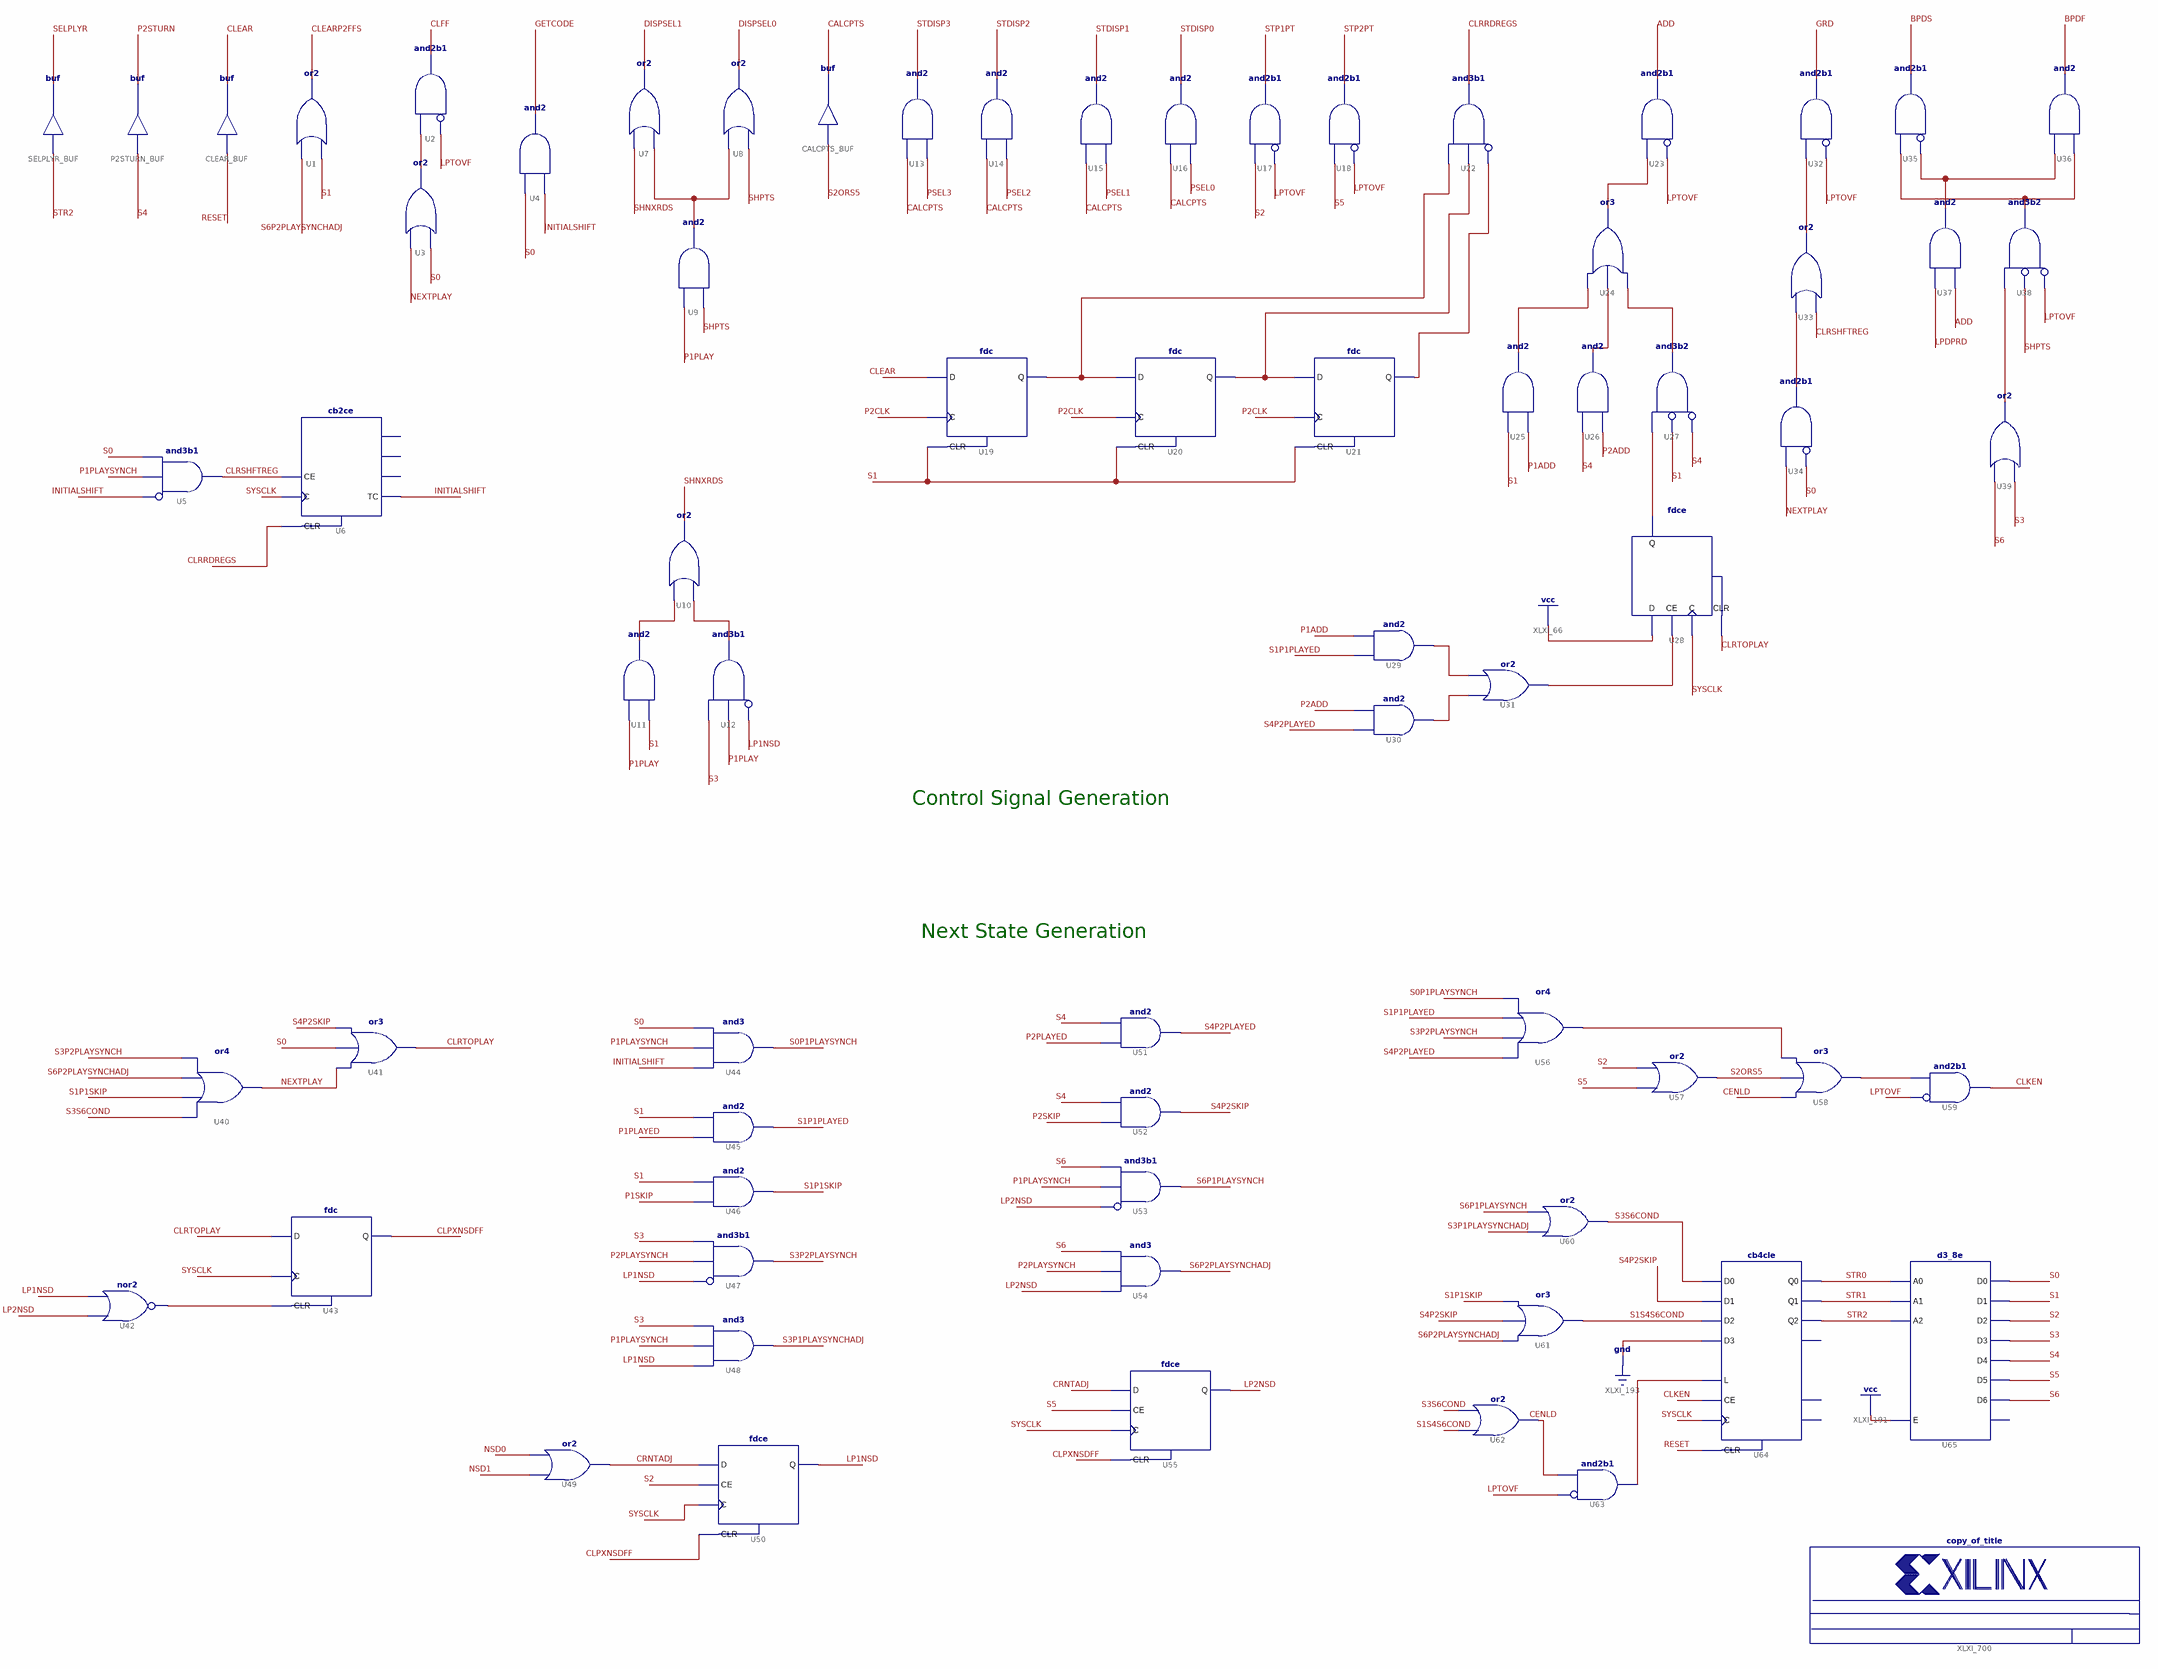
[diagram p0: schematic sheet 1]
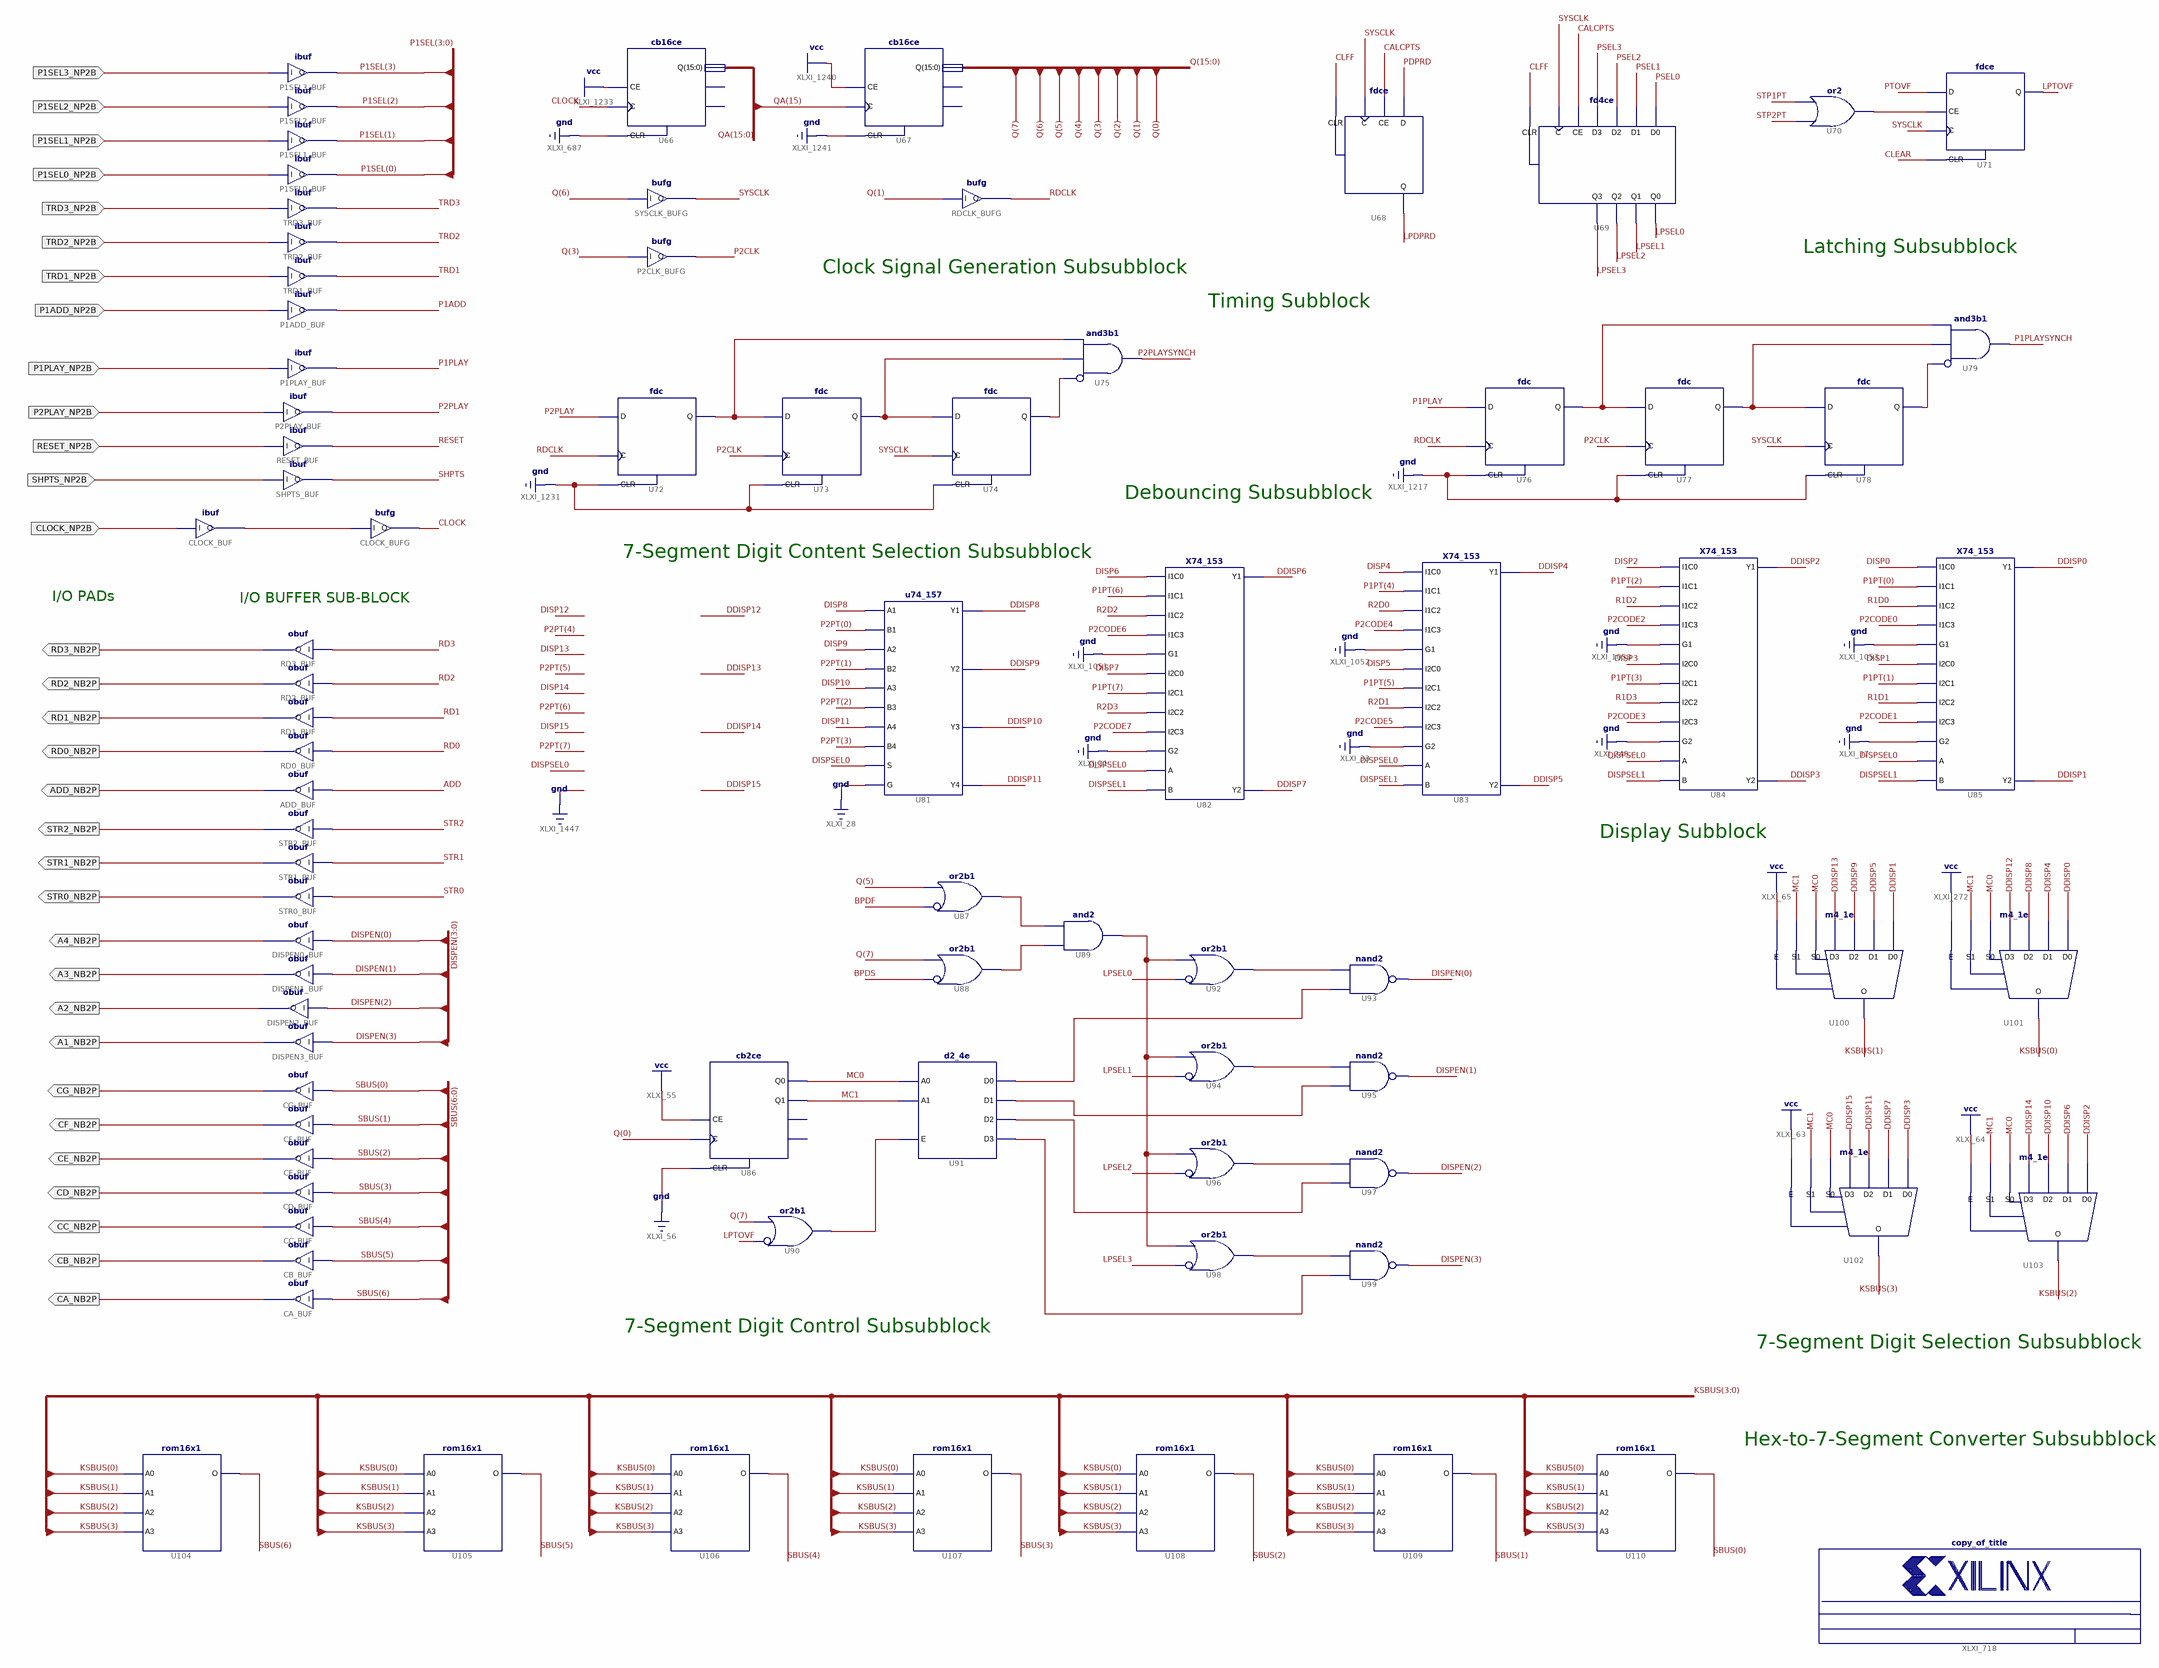
[diagram p1: schematic sheet 2]
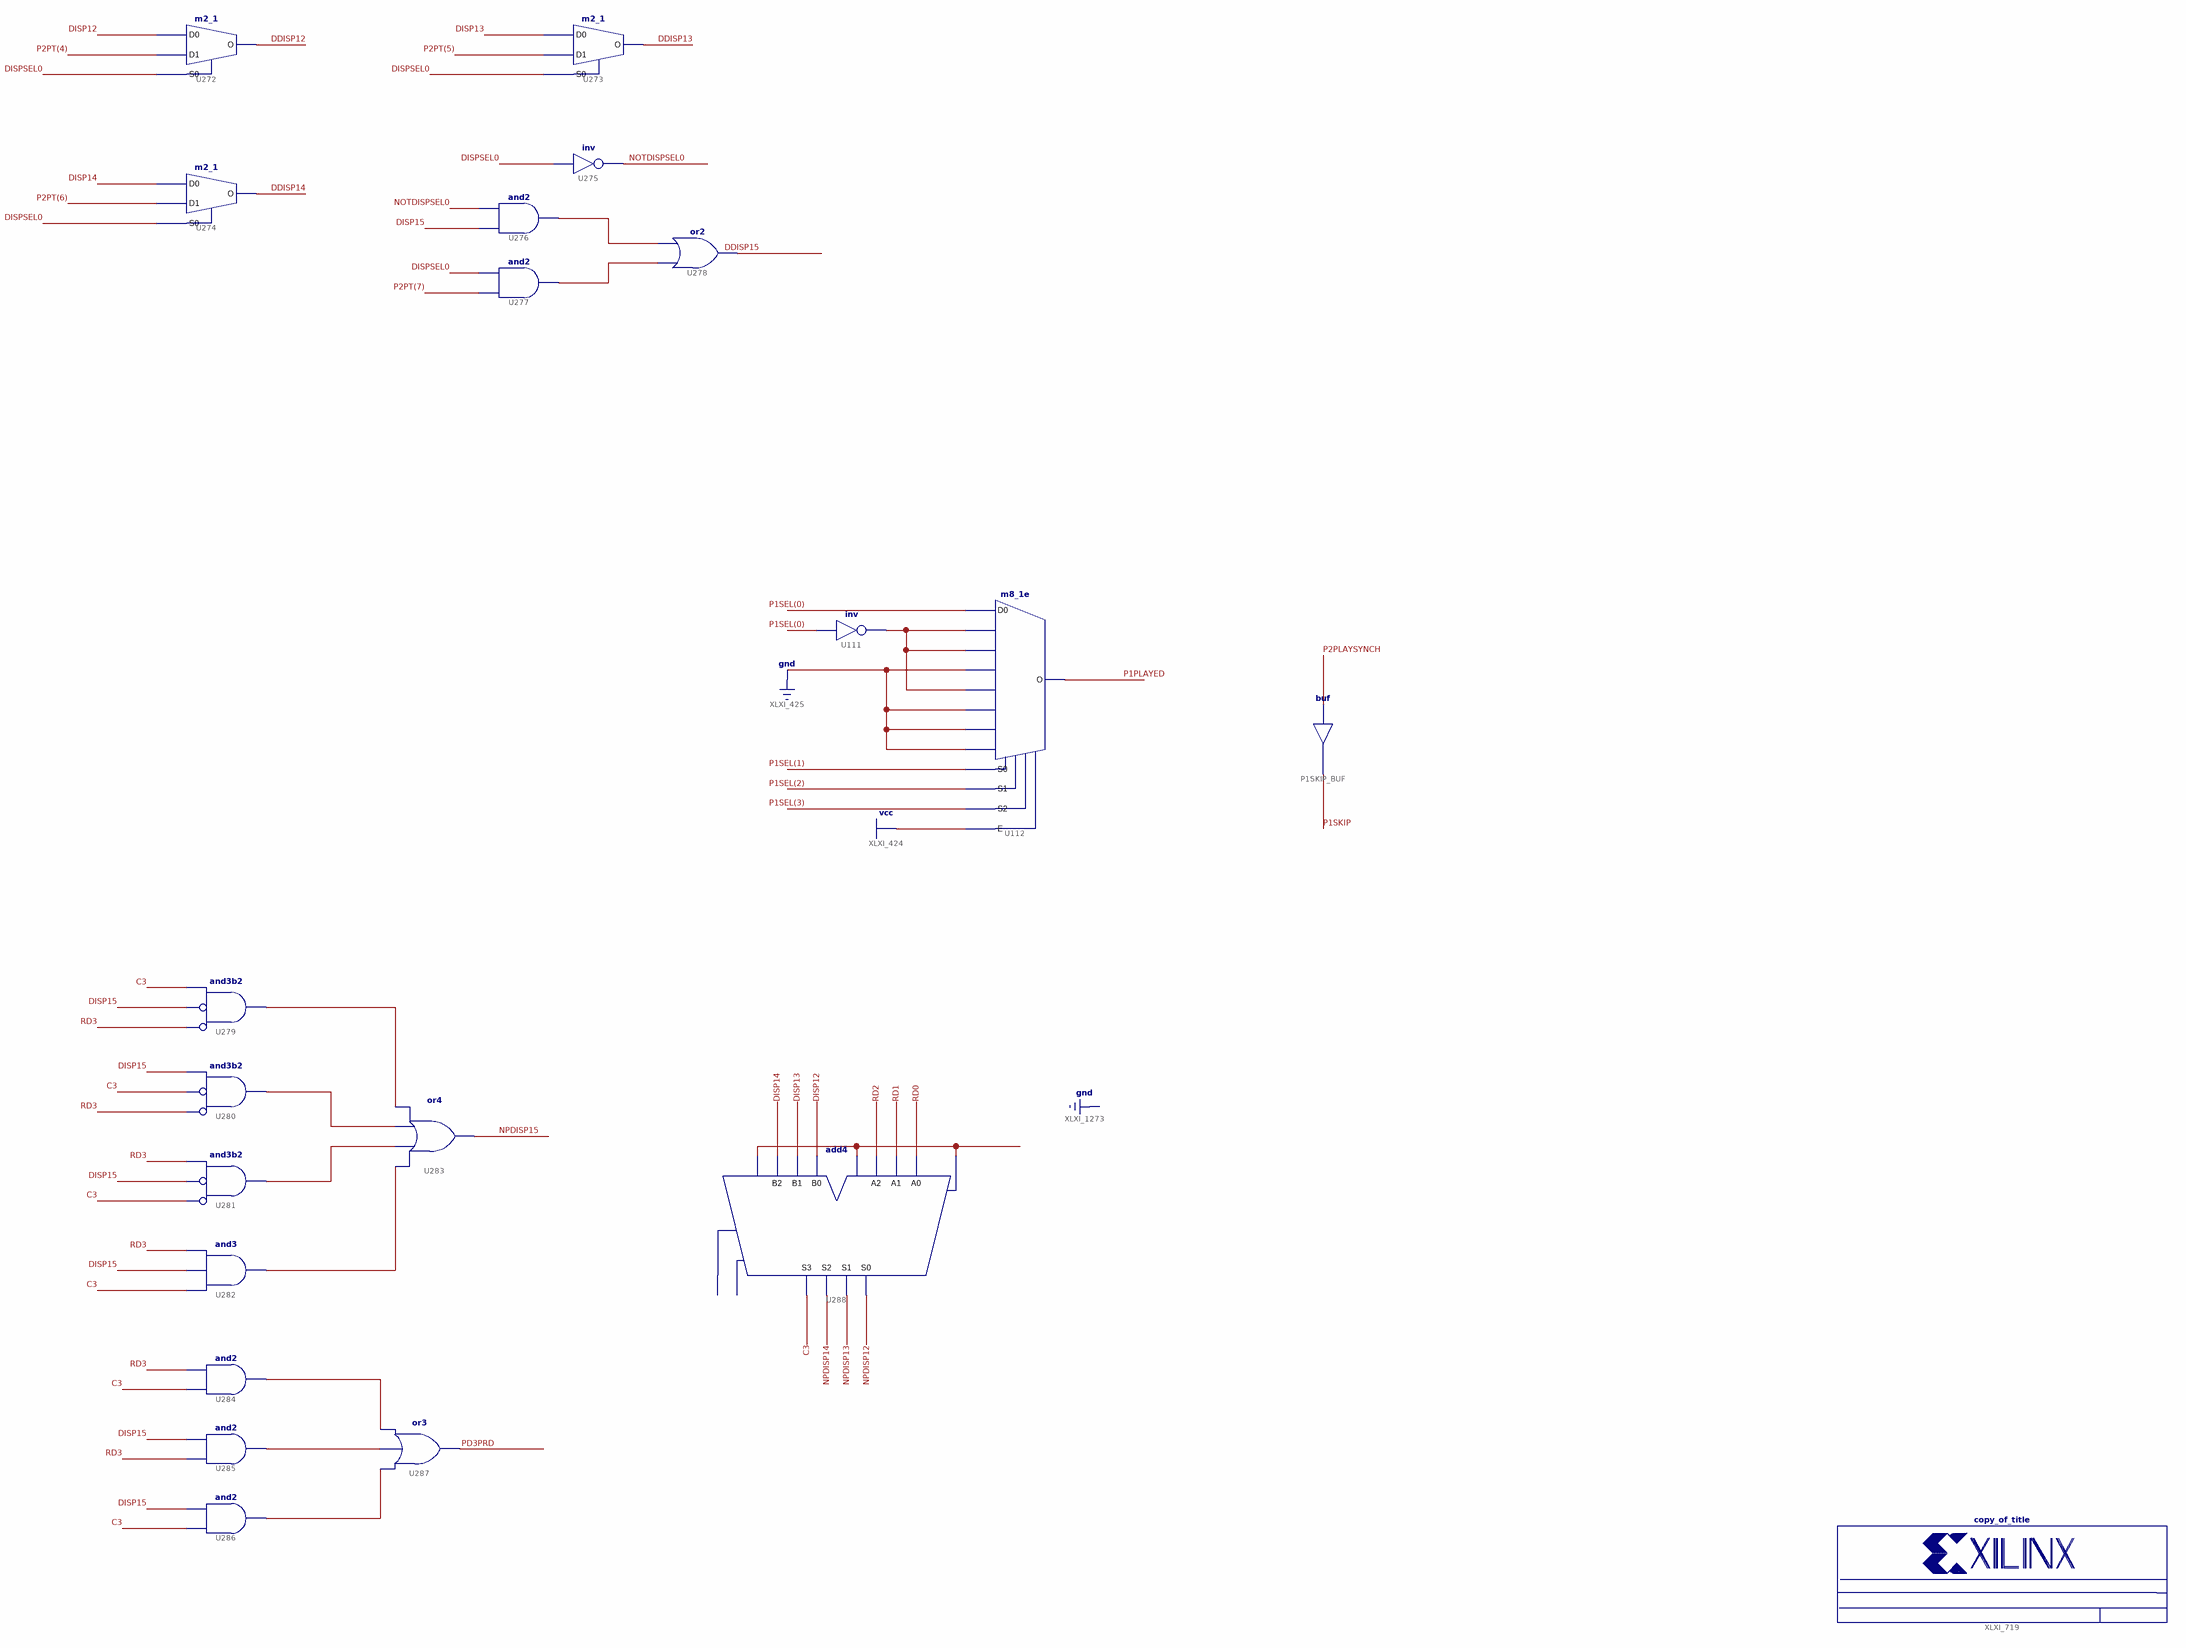
[diagram p2: schematic sheet 3]
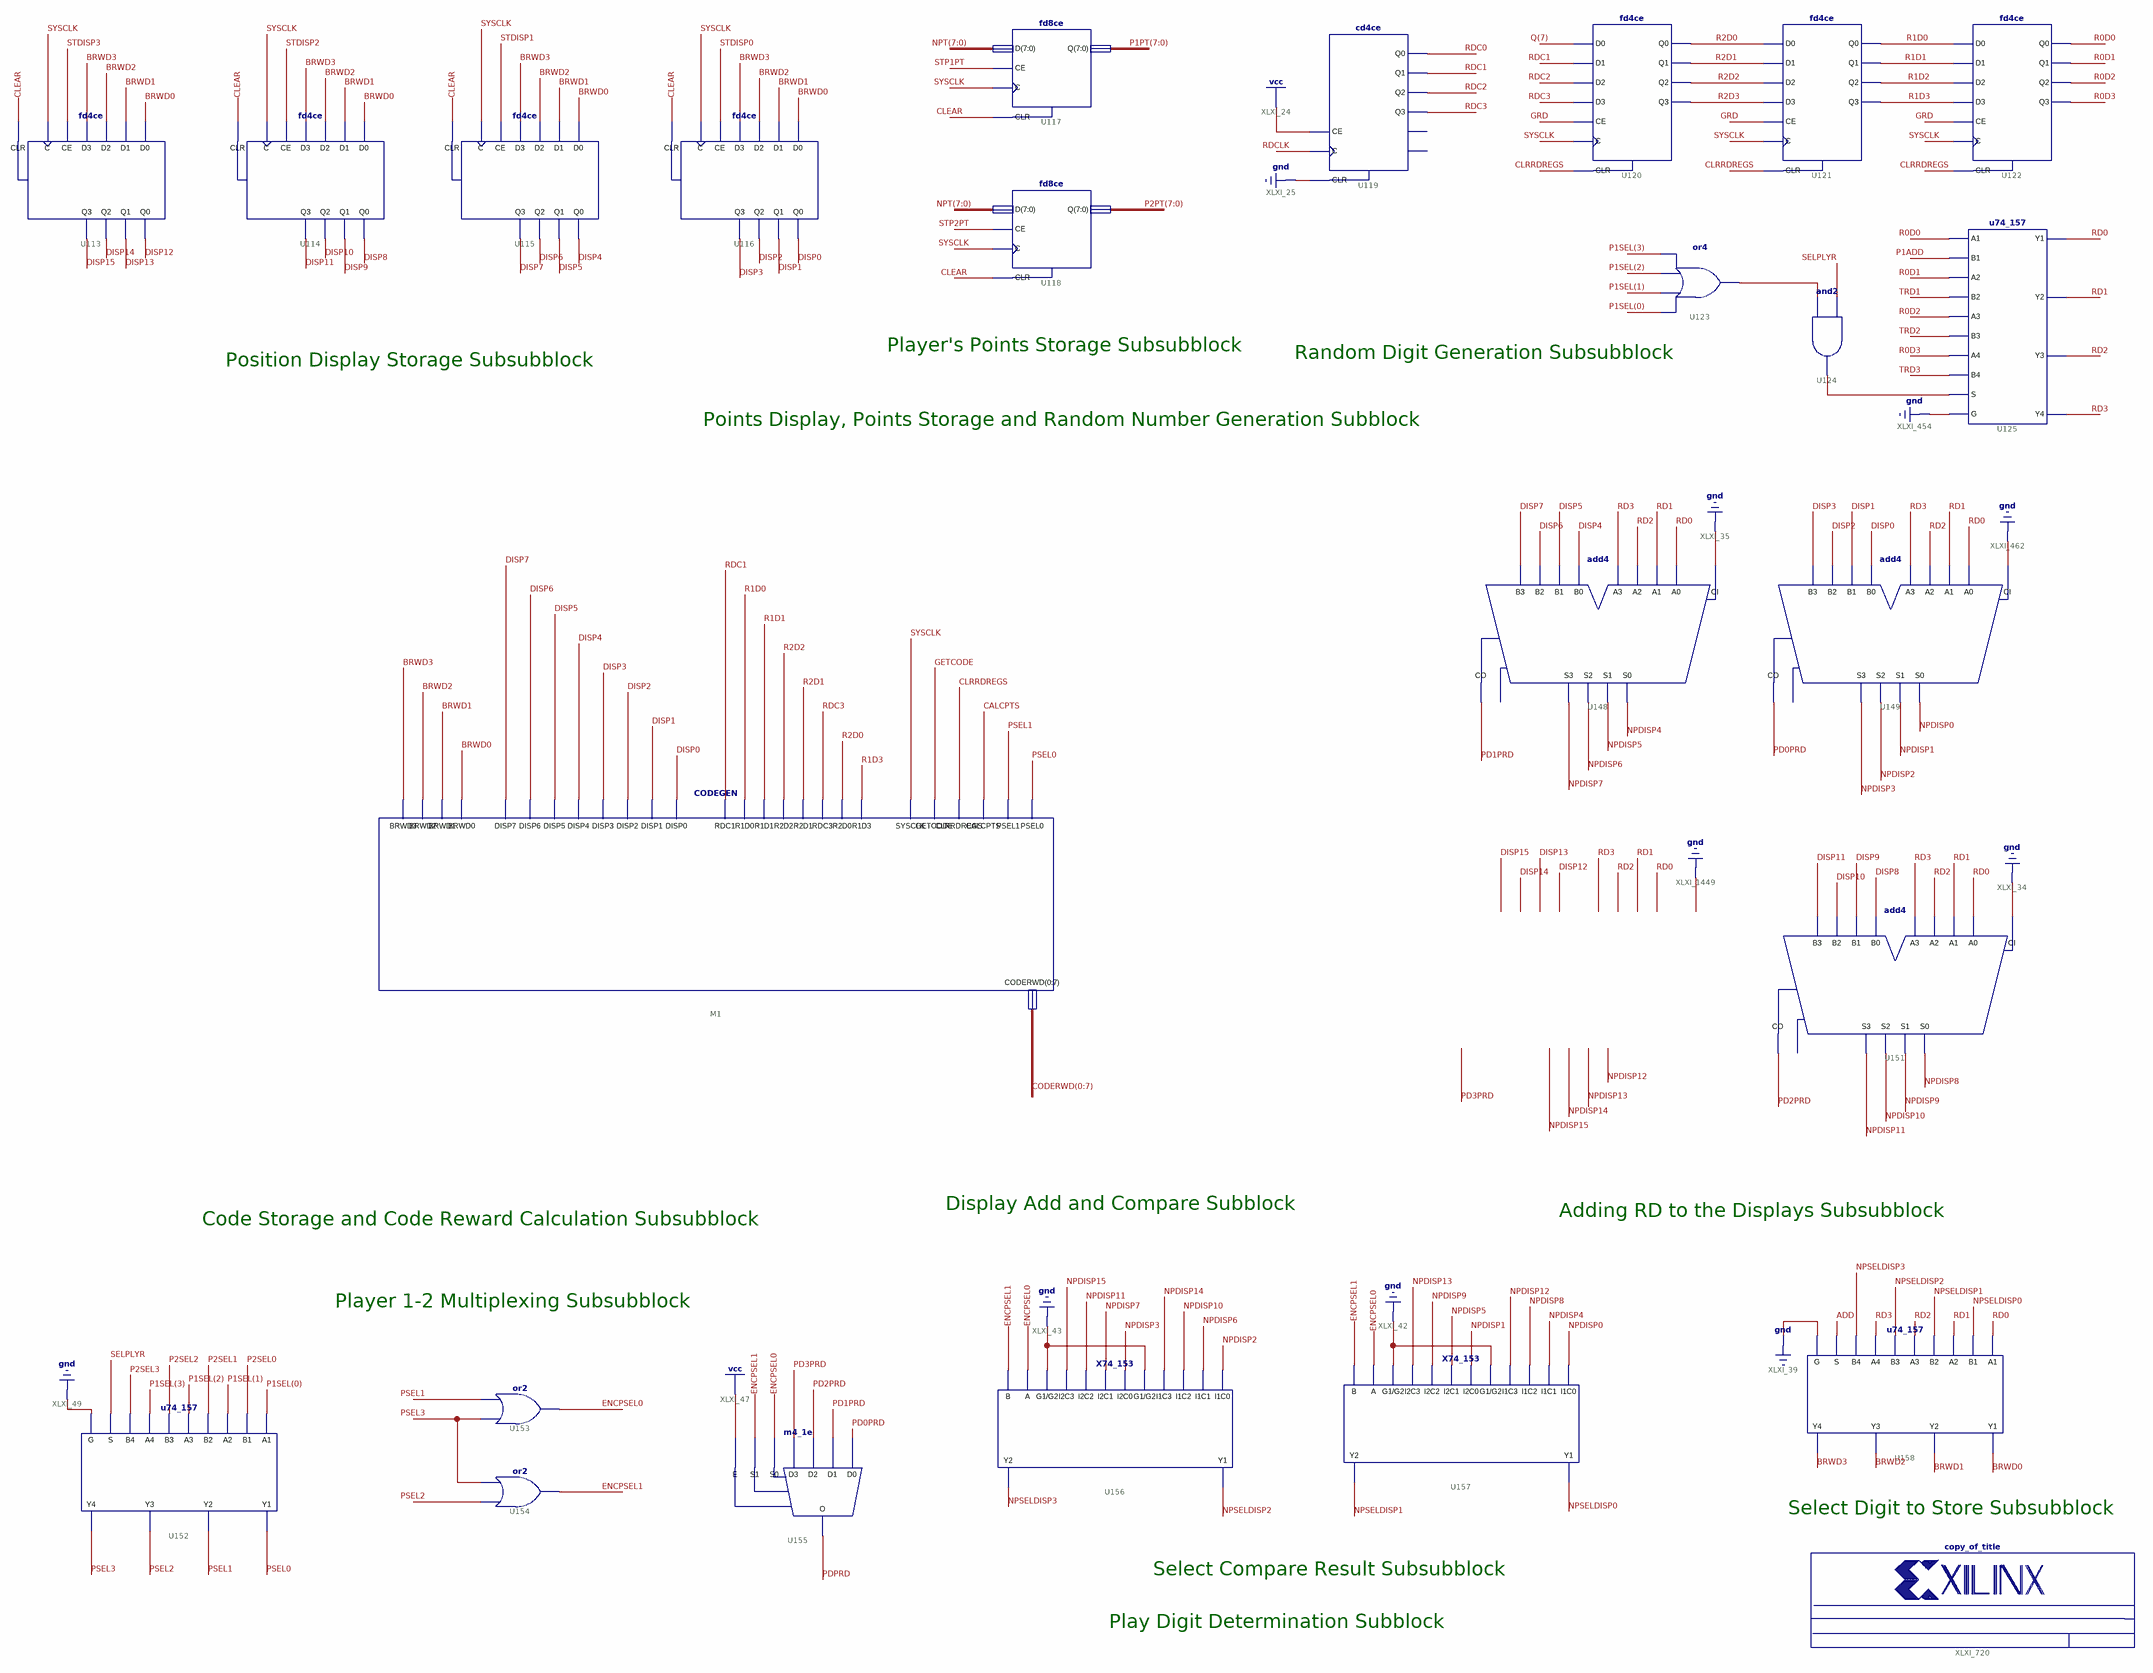
[diagram p3: schematic sheet 4]
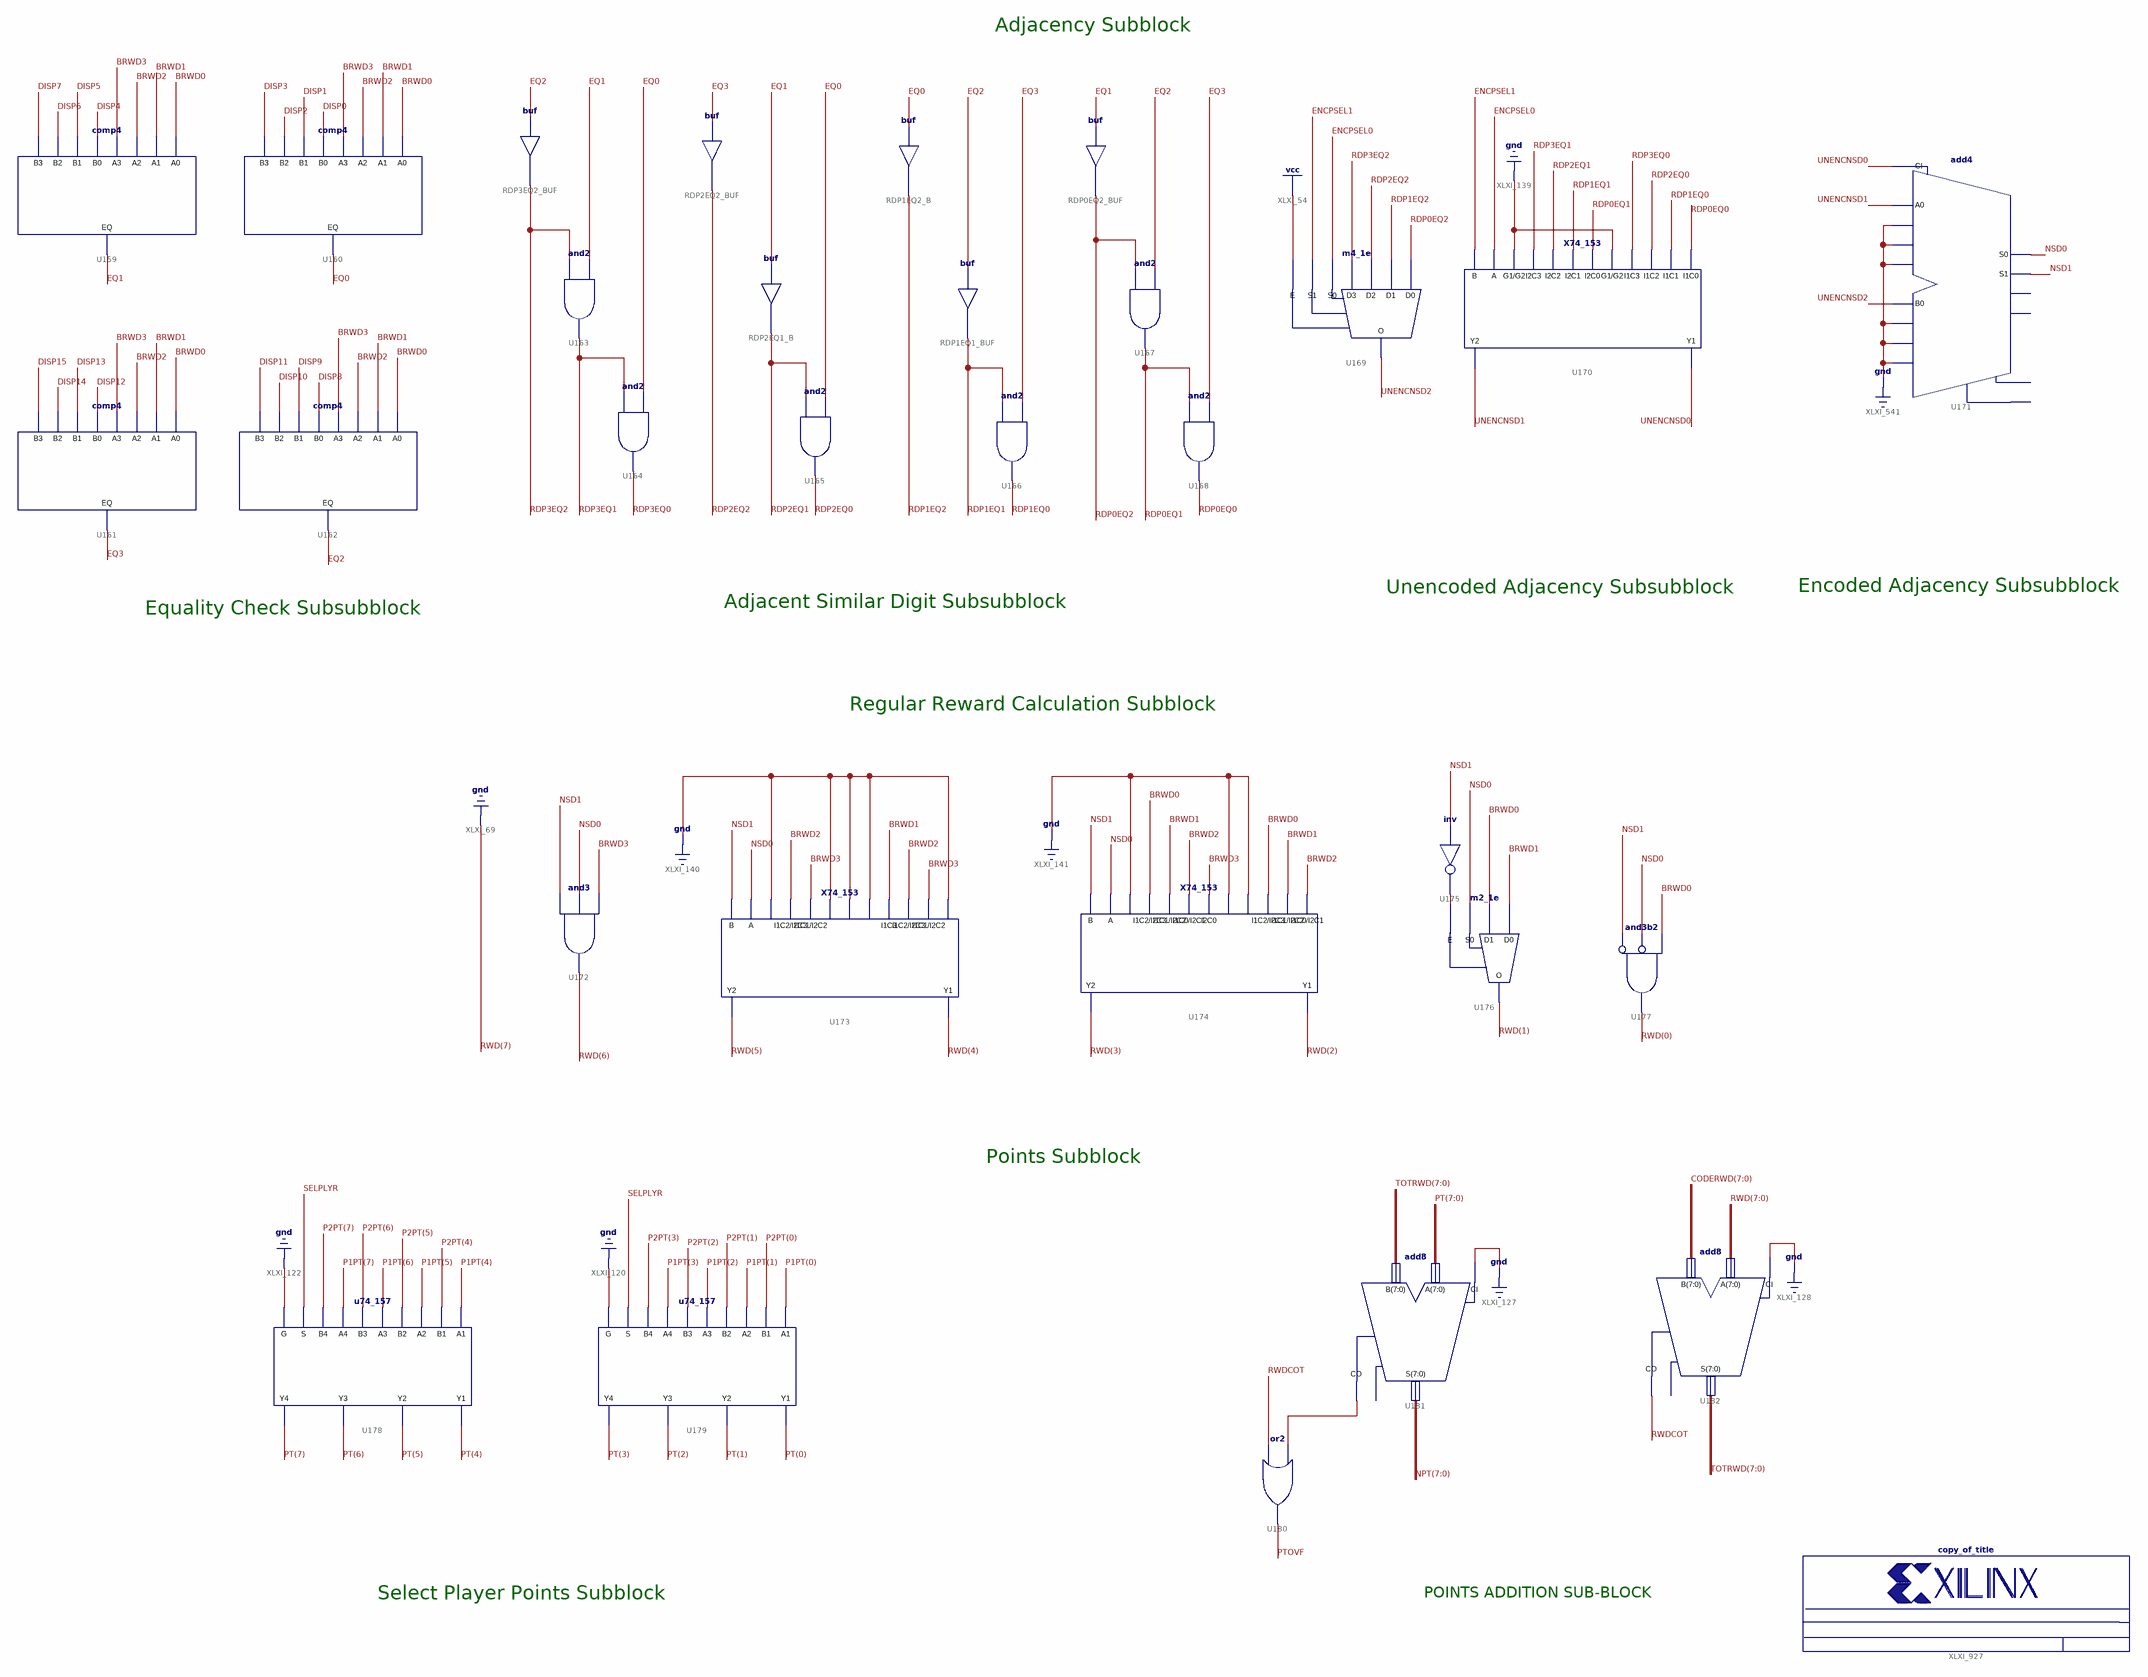
[diagram p4: schematic sheet 5]
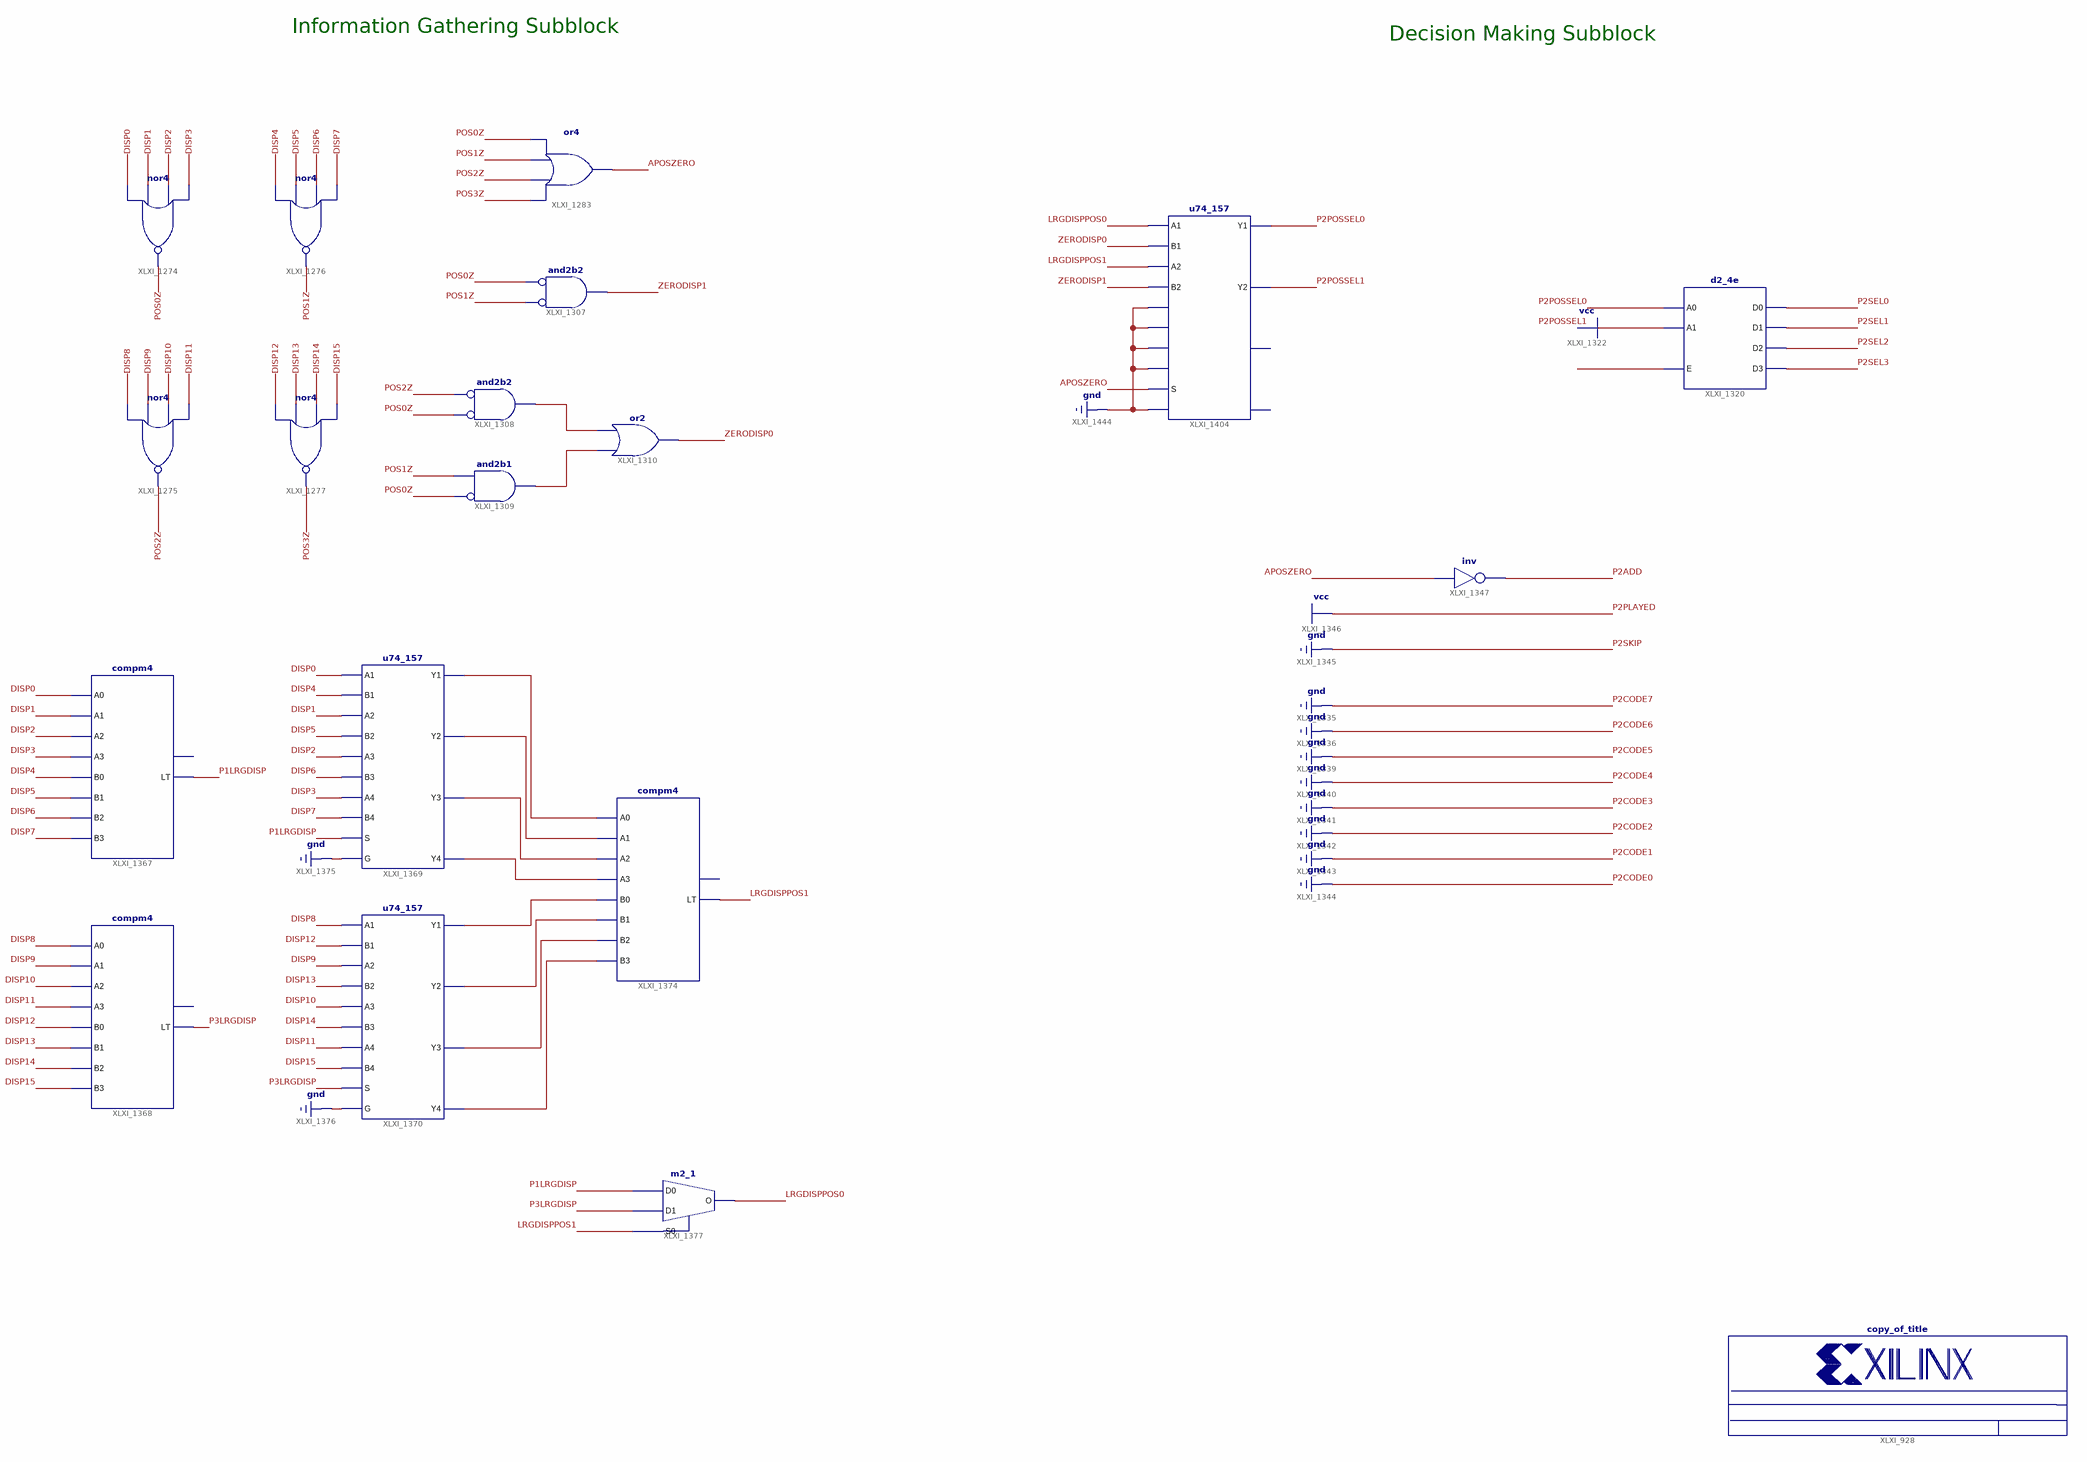
[diagram p5: schematic sheet 6]
// Xilinx ISE schematic ppm.sch (spartan3e) as structural Verilog: 247 symbols, 32 ports
module ppm (
  input  P1ADD_NP2B,
  input  TRD1_NP2B,
  input  TRD2_NP2B,
  input  TRD3_NP2B,
  input  P1SEL0_NP2B,
  input  P1SEL1_NP2B,
  input  P1SEL2_NP2B,
  input  P1SEL3_NP2B,
  input  P1PLAY_NP2B,
  input  RESET_NP2B,
  input  SHPTS_NP2B,
  input  CLOCK_NP2B,
  input  P2PLAY_NP2B,
  output RD3_NB2P,
  output RD2_NB2P,
  output RD1_NB2P,
  output RD0_NB2P,
  output ADD_NB2P,
  output STR2_NB2P,
  output STR1_NB2P,
  output STR0_NB2P,
  output A4_NB2P,
  output A3_NB2P,
  output A1_NB2P,
  output CG_NB2P,
  output CF_NB2P,
  output CE_NB2P,
  output CD_NB2P,
  output CC_NB2P,
  output CB_NB2P,
  output CA_NB2P,
  output A2_NB2P
);

  wire ADD, APOSZERO, BPDF, BPDS, BRWD0, BRWD1, BRWD2, BRWD3, C3, CALCPTS, CENLD, CLEAR, CLEARP2FFS, CLFF,
       CLKEN, CLOCK, CLPXNSDFF, CLRRDREGS, CLRSHFTREG, CLRTOPLAY, CRNTADJ, DDISP0, DDISP1, DDISP2, DDISP3,
       DDISP4, DDISP5, DDISP6, DDISP7, DDISP8, DDISP9, DDISP10, DDISP11, DDISP12, DDISP13, DDISP14, DDISP15,
       DISP0, DISP1, DISP2, DISP3, DISP4, DISP5, DISP6, DISP7, DISP8, DISP9, DISP10, DISP11, DISP12, DISP13,
       DISP14, DISP15, DISPSEL0, DISPSEL1, ENCPSEL0, ENCPSEL1, EQ0, EQ1, EQ2, EQ3, GETCODE, GRD,
       INITIALSHIFT, INT_NET0, INT_NET1, INT_NET2, INT_NET3, INT_NET6, INT_NET8, INT_NET10, INT_NET11,
       LP1NSD, LP2NSD, LPDPRD, LPSEL0, LPSEL1, LPSEL2, LPSEL3, LPTOVF, LRGDISPPOS0, LRGDISPPOS1, MC0, MC1,
       NEXTPLAY, NOTDISPSEL0, NPDISP0, NPDISP1, NPDISP2, NPDISP3, NPDISP4, NPDISP5, NPDISP6, NPDISP7,
       NPDISP8, NPDISP9, NPDISP10, NPDISP11, NPDISP12, NPDISP13, NPDISP14, NPDISP15, NPSELDISP0, NPSELDISP1,
       NPSELDISP2, NPSELDISP3, NSD0, NSD1, P1ADD, P1LRGDISP, P1PLAY, P1PLAYED, P1PLAYSYNCH, P1SKIP, P2ADD,
       P2CLK, P2PLAY, P2PLAYSYNCH, P2POSSEL0, P2POSSEL1, P2SEL0, P2SEL1, P2SEL2, P2SEL3, P2STURN, P3LRGDISP,
       PD0PRD, PD1PRD, PD2PRD, PD3PRD, PDPRD, POS0Z, POS1Z, POS2Z, POS3Z, PSEL0, PSEL1, PSEL2, PSEL3, PTOVF,
       R0D0, R0D1, R0D2, R0D3, R1D0, R1D1, R1D2, R1D3, R2D0, R2D1, R2D2, R2D3, RD0, RD1, RD2, RD3, RDC0,
       RDC1, RDC2, RDC3, RDCLK, RDP0EQ0, RDP0EQ1, RDP0EQ2, RDP1EQ0, RDP1EQ1, RDP1EQ2, RDP2EQ0, RDP2EQ1,
       RDP2EQ2, RDP3EQ0, RDP3EQ1, RDP3EQ2, RESET, RWDCOT, S0, S0P1PLAYSYNCH, S1, S1P1PLAYED, S1P1SKIP,
       S1S4S6COND, S2, S2ORS5, S3, S3P1PLAYSYNCHADJ, S3P2PLAYSYNCH, S3S6COND, S4, S4P2PLAYED, S4P2SKIP, S5,
       S6, S6P1PLAYSYNCH, S6P2PLAYSYNCHADJ, SELPLYR, SHNXRDS, SHPTS, STDISP0, STDISP1, STDISP2, STDISP3,
       STP1PT, STP2PT, STR0, STR1, STR2, SYSCLK, TRD1, TRD2, TRD3, UNENCNSD0, UNENCNSD1, UNENCNSD2, XLXN_12,
       XLXN_19, XLXN_74, XLXN_140, XLXN_141, XLXN_149, XLXN_151, XLXN_156, XLXN_163, XLXN_164, XLXN_181,
       XLXN_188, XLXN_193, XLXN_194, XLXN_195, XLXN_197, XLXN_199, XLXN_201, XLXN_202, XLXN_203, XLXN_210,
       XLXN_460, XLXN_462, XLXN_474, XLXN_1195, XLXN_1346, XLXN_1347, XLXN_1764, XLXN_1802, XLXN_2370,
       XLXN_9551, XLXN_9714, XLXN_10471, XLXN_10478, XLXN_10482, XLXN_10484, XLXN_10495, XLXN_10958,
       XLXN_10960, XLXN_10962, XLXN_11102, XLXN_11289, XLXN_11290, XLXN_11291, XLXN_11292, XLXN_11293,
       XLXN_11294, XLXN_11314, XLXN_11315, XLXN_11316, XLXN_11554, XLXN_11555, XLXN_11725, XLXN_11726,
       XLXN_11727, XLXN_11728, XLXN_11729, XLXN_11730, XLXN_11731, XLXN_11732, ZERODISP0, ZERODISP1;
  wire [3:0] DISPEN, KSBUS, P1SEL;
  wire [6:0] RWD, SBUS;
  wire [7:0] CODERWD, NPT, P1PT, P2PT, PT, TOTRWD;
  wire [15:0] Q, QA;

  m8_1e U112 (
    .D0(P1SEL[0]), .D1(XLXN_1195), .D2(XLXN_1195), .D3(1'b0), .D4(XLXN_1195), .D5(1'b0), .D6(1'b0),
    .D7(1'b0), .E(1'b1), .S0(P1SEL[1]), .S1(P1SEL[2]), .S2(P1SEL[3]), .O(P1PLAYED));
  not U111 (XLXN_1195, P1SEL[0]);
  X74_153 U85 (
    .I1C0(DISP0), .I1C1(P1PT[0]), .I1C2(R1D0), .I1C3(1'b0), .G1(1'b0), .I2C0(DISP1), .I2C1(P1PT[1]),
    .I2C2(R1D1), .I2C3(1'b0), .G2(1'b0), .A(DISPSEL0), .B(DISPSEL1), .Y1(DDISP0), .Y2(DDISP1));
  X74_153 U84 (
    .I1C0(DISP2), .I1C1(P1PT[2]), .I1C2(R1D2), .I1C3(1'b0), .G1(1'b0), .I2C0(DISP3), .I2C1(P1PT[3]),
    .I2C2(R1D3), .I2C3(1'b0), .G2(1'b0), .A(DISPSEL0), .B(DISPSEL1), .Y1(DDISP2), .Y2(DDISP3));
  X74_153 U83 (
    .I1C0(DISP4), .I1C1(P1PT[4]), .I1C2(R2D0), .I1C3(1'b0), .G1(1'b0), .I2C0(DISP5), .I2C1(P1PT[5]),
    .I2C2(R2D1), .I2C3(1'b0), .G2(1'b0), .A(DISPSEL0), .B(DISPSEL1), .Y1(DDISP4), .Y2(DDISP5));
  X74_153 U82 (
    .I1C0(DISP6), .I1C1(P1PT[6]), .I1C2(R2D2), .I1C3(1'b0), .G1(1'b0), .I2C0(DISP7), .I2C1(P1PT[7]),
    .I2C2(R2D3), .I2C3(1'b0), .G2(1'b0), .A(DISPSEL0), .B(DISPSEL1), .Y1(DDISP6), .Y2(DDISP7));
  rom16x1 #(.INIT("2812")) U104 (.A0(KSBUS[0]), .A1(KSBUS[1]), .A2(KSBUS[2]), .A3(KSBUS[3]), .O(SBUS[6]));
  rom16x1 #(.INIT("D860")) U105 (.A0(KSBUS[0]), .A1(KSBUS[1]), .A2(KSBUS[2]), .A3(KSBUS[3]), .O(SBUS[5]));
  rom16x1 #(.INIT("D004")) U106 (.A0(KSBUS[0]), .A1(KSBUS[1]), .A2(KSBUS[2]), .A3(KSBUS[3]), .O(SBUS[4]));
  rom16x1 #(.INIT("8692")) U107 (.A0(KSBUS[0]), .A1(KSBUS[1]), .A2(KSBUS[2]), .A3(KSBUS[3]), .O(SBUS[3]));
  rom16x1 #(.INIT("02BA")) U108 (.A0(KSBUS[0]), .A1(KSBUS[1]), .A2(KSBUS[2]), .A3(KSBUS[3]), .O(SBUS[2]));
  rom16x1 #(.INIT("208E")) U109 (.A0(KSBUS[0]), .A1(KSBUS[1]), .A2(KSBUS[2]), .A3(KSBUS[3]), .O(SBUS[1]));
  rom16x1 #(.INIT("1083")) U110 (.A0(KSBUS[0]), .A1(KSBUS[1]), .A2(KSBUS[2]), .A3(KSBUS[3]), .O(SBUS[0]));
  and U5 (CLRSHFTREG, ~INITIALSHIFT, P1PLAYSYNCH, S0);  // and3b1
  and U29 (XLXN_164, S1P1PLAYED, P1ADD);
  and U30 (XLXN_163, S4P2PLAYED, P2ADD);
  or U31 (INT_NET10, XLXN_163, XLXN_164);
  fdce U28 (.C(SYSCLK), .CE(INT_NET10), .CLR(CLRTOPLAY), .D(1'b1), .Q(XLXN_156));
  and U48 (S3P1PLAYSYNCHADJ, LP1NSD, P1PLAYSYNCH, S3);
  and U47 (S3P2PLAYSYNCH, ~LP1NSD, P2PLAYSYNCH, S3);  // and3b1
  and U46 (S1P1SKIP, P1SKIP, S1);
  and U45 (S1P1PLAYED, P1PLAYED, S1);
  and U44 (S0P1PLAYSYNCH, INITIALSHIFT, P1PLAYSYNCH, S0);
  nor U42 (INT_NET11, LP2NSD, LP1NSD);
  fdc U43 (.C(SYSCLK), .CLR(INT_NET11), .D(CLRTOPLAY), .Q(CLPXNSDFF));
  and U63 (XLXN_474, ~LPTOVF, CENLD);  // and2b1
  or U60 (S3S6COND, S3P1PLAYSYNCHADJ, S6P1PLAYSYNCH);
  cb4cle U64 (
    .C(SYSCLK), .CE(CLKEN), .CLR(RESET), .D0(S3S6COND), .D1(S4P2SKIP), .D2(S1S4S6COND), .D3(1'b0),
    .L(XLXN_474), .Q0(STR0), .Q1(STR1), .Q2(STR2));  // open: CEO, Q3, TC
  d3_8e U65 (
    .A0(STR0), .A1(STR1), .A2(STR2), .E(1'b1), .D0(S0), .D1(S1), .D2(S2), .D3(S3), .D4(S4), .D5(S5), .D6(S6));  // open: D7
  or U40 (NEXTPLAY, S3S6COND, S1P1SKIP, S6P2PLAYSYNCHADJ, S3P2PLAYSYNCH);
  or U41 (CLRTOPLAY, NEXTPLAY, S0, S4P2SKIP);
  or U88 (XLXN_203, ~BPDS, Q[7]);  // or2b1
  cb2ce U86 (.C(Q[0]), .CE(1'b1), .CLR(1'b0), .Q0(MC0), .Q1(MC1));  // open: CEO, TC
  d2_4e U91 (.A0(MC0), .A1(MC1), .E(XLXN_210), .D0(INT_NET3), .D1(XLXN_197), .D2(XLXN_199), .D3(XLXN_201));
  and U89 (INT_NET0, XLXN_203, XLXN_202);
  or U92 (XLXN_181, ~LPSEL0, INT_NET0);  // or2b1
  or U94 (XLXN_195, ~LPSEL1, INT_NET0);  // or2b1
  or U96 (XLXN_194, ~LPSEL2, INT_NET0);  // or2b1
  or U98 (XLXN_193, ~LPSEL3, INT_NET0);  // or2b1
  or U90 (XLXN_210, ~LPTOVF, Q[7]);  // or2b1
  nand U95 (DISPEN[1], XLXN_197, XLXN_195);
  nand U97 (DISPEN[2], XLXN_199, XLXN_194);
  nand U99 (DISPEN[3], XLXN_201, XLXN_193);
  nand U93 (DISPEN[0], INT_NET3, XLXN_181);
  or U87 (XLXN_202, ~BPDF, Q[5]);  // or2b1
  u74_157 U81 (
    .S(DISPSEL0), .G(1'b0), .Y1(DDISP8), .Y2(DDISP9), .Y3(DDISP10), .Y4(DDISP11), .A1(DISP8), .B4(P2PT[3]),
    .B1(P2PT[0]), .A4(DISP11), .A2(DISP9), .B3(P2PT[2]), .B2(P2PT[1]), .A3(DISP10));
  ibuf P1SEL3_BUF (.I(P1SEL3_NP2B), .O(P1SEL[3]));
  ibuf P1SEL2_BUF (.I(P1SEL2_NP2B), .O(P1SEL[2]));
  ibuf P1SEL1_BUF (.I(P1SEL1_NP2B), .O(P1SEL[1]));
  ibuf P1SEL0_BUF (.I(P1SEL0_NP2B), .O(P1SEL[0]));
  ibuf TRD3_BUF (.I(TRD3_NP2B), .O(TRD3));
  ibuf TRD2_BUF (.I(TRD2_NP2B), .O(TRD2));
  ibuf TRD1_BUF (.I(TRD1_NP2B), .O(TRD1));
  ibuf P1ADD_BUF (.I(P1ADD_NP2B), .O(P1ADD));
  ibuf RESET_BUF (.I(RESET_NP2B), .O(RESET));
  ibuf SHPTS_BUF (.I(SHPTS_NP2B), .O(SHPTS));
  ibuf CLOCK_BUF (.I(CLOCK_NP2B), .O(XLXN_2370));
  bufg CLOCK_BUFG (.I(XLXN_2370), .O(CLOCK));
  ibuf P1PLAY_BUF (.I(P1PLAY_NP2B), .O(P1PLAY));
  obuf RD3_BUF (.I(RD3), .O(RD3_NB2P));
  obuf RD2_BUF (.I(RD2), .O(RD2_NB2P));
  obuf RD1_BUF (.I(RD1), .O(RD1_NB2P));
  obuf RD0_BUF (.I(RD0), .O(RD0_NB2P));
  obuf ADD_BUF (.I(ADD), .O(ADD_NB2P));
  obuf STR2_BUF (.I(STR2), .O(STR2_NB2P));
  obuf STR1_BUF (.I(STR1), .O(STR1_NB2P));
  obuf STR0_BUF (.I(STR0), .O(STR0_NB2P));
  obuf DISPEN0_BUF (.I(DISPEN[0]), .O(A4_NB2P));
  obuf DISPEN1_BUF (.I(DISPEN[1]), .O(A3_NB2P));
  obuf DISPEN2_BUF (.I(DISPEN[2]), .O(A2_NB2P));
  obuf DISPEN3_BUF (.I(DISPEN[3]), .O(A1_NB2P));
  obuf CG_BUF (.I(SBUS[0]), .O(CG_NB2P));
  obuf CF_BUF (.I(SBUS[1]), .O(CF_NB2P));
  obuf CE_BUF (.I(SBUS[2]), .O(CE_NB2P));
  obuf CD_BUF (.I(SBUS[3]), .O(CD_NB2P));
  obuf CC_BUF (.I(SBUS[4]), .O(CC_NB2P));
  obuf CB_BUF (.I(SBUS[5]), .O(CB_NB2P));
  obuf CA_BUF (.I(SBUS[6]), .O(CA_NB2P));
  buf SELPLYR_BUF (SELPLYR, STR2);
  buf P2STURN_BUF (P2STURN, S4);
  or U1 (CLEARP2FFS, S1, S6P2PLAYSYNCHADJ);
  and U2 (CLFF, ~LPTOVF, XLXN_12);  // and2b1
  or U3 (XLXN_12, S0, NEXTPLAY);
  or U7 (DISPSEL1, XLXN_19, SHNXRDS);
  or U8 (DISPSEL0, SHPTS, XLXN_19);
  and U9 (XLXN_19, SHPTS, P1PLAY);
  or U10 (SHNXRDS, XLXN_141, XLXN_140);
  and U11 (XLXN_140, S1, P1PLAY);
  and U12 (XLXN_141, ~LP1NSD, P1PLAY, S3);  // and3b1
  buf CALCPTS_BUF (CALCPTS, S2ORS5);
  and U13 (STDISP3, PSEL3, CALCPTS);
  and U14 (STDISP2, PSEL2, CALCPTS);
  and U36 (BPDF, INT_NET1, INT_NET2);
  and U38 (INT_NET1, ~LPTOVF, ~SHPTS, XLXN_188);  // and3b2
  and U37 (INT_NET2, ADD, LPDPRD);
  and U35 (BPDS, ~INT_NET2, INT_NET1);  // and2b1
  or U33 (INT_NET6, CLRSHFTREG, INT_NET8);
  and U34 (INT_NET8, ~S0, NEXTPLAY);  // and2b1
  and U32 (GRD, ~LPTOVF, INT_NET6);  // and2b1
  and U27 (XLXN_151, ~S4, ~S1, XLXN_156);  // and3b2
  or U24 (XLXN_9551, XLXN_151, XLXN_149, XLXN_9714);
  and U15 (STDISP1, PSEL1, CALCPTS);
  and U25 (XLXN_9714, P1ADD, S1);
  and U26 (XLXN_149, P2ADD, S4);
  or U39 (XLXN_188, S3, S6);
  or U62 (CENLD, S1S4S6COND, S3S6COND);
  fdce U50 (.C(SYSCLK), .CE(S2), .CLR(CLPXNSDFF), .D(CRNTADJ), .Q(LP1NSD));
  or U49 (CRNTADJ, NSD1, NSD0);
  fdce U55 (.C(SYSCLK), .CE(S5), .CLR(CLPXNSDFF), .D(CRNTADJ), .Q(LP2NSD));
  and U54 (S6P2PLAYSYNCHADJ, LP2NSD, P2PLAYSYNCH, S6);
  and U53 (S6P1PLAYSYNCH, ~LP2NSD, P1PLAYSYNCH, S6);  // and3b1
  and U52 (S4P2SKIP, 1'b0, S4);
  and U51 (S4P2PLAYED, 1'b1, S4);
  or U56 (XLXN_460, S4P2PLAYED, S3P2PLAYSYNCH, S1P1PLAYED, S0P1PLAYSYNCH);
  and U59 (CLKEN, ~LPTOVF, XLXN_462);  // and2b1
  or U57 (S2ORS5, S5, S2);
  or U58 (XLXN_462, CENLD, S2ORS5, XLXN_460);
  or U61 (S1S4S6COND, S6P2PLAYSYNCHADJ, S4P2SKIP, S1P1SKIP);
  m4_1e U103 (.D0(DDISP2), .D1(DDISP6), .D2(DDISP10), .D3(DDISP14), .E(1'b1), .S0(MC0), .S1(MC1), .O(KSBUS[2]));
  m4_1e U102 (.D0(DDISP3), .D1(DDISP7), .D2(DDISP11), .D3(DDISP15), .E(1'b1), .S0(MC0), .S1(MC1), .O(KSBUS[3]));
  m4_1e U101 (.D0(DDISP0), .D1(DDISP4), .D2(DDISP8), .D3(DDISP12), .E(1'b1), .S0(MC0), .S1(MC1), .O(KSBUS[0]));
  m4_1e U100 (.D0(DDISP1), .D1(DDISP5), .D2(DDISP9), .D3(DDISP13), .E(1'b1), .S0(MC0), .S1(MC1), .O(KSBUS[1]));
  copy_of_title #(.TitleFieldText("Ppm Control Unit      CS2204 - E - Fall 2013"), .NameFieldText("Benson Tsai; Sharan Juangphanich; Alvi Kabir; Sean Whalen")) XLXI_700 ();
  fd4ce U122 (
    .C(SYSCLK), .CE(GRD), .CLR(CLRRDREGS), .D0(R1D0), .D1(R1D1), .D2(R1D2), .D3(R1D3), .Q0(R0D0), .Q1(R0D1),
    .Q2(R0D2), .Q3(R0D3));
  fd4ce U121 (
    .C(SYSCLK), .CE(GRD), .CLR(CLRRDREGS), .D0(R2D0), .D1(R2D1), .D2(R2D2), .D3(R2D3), .Q0(R1D0), .Q1(R1D1),
    .Q2(R1D2), .Q3(R1D3));
  fd4ce U120 (
    .C(SYSCLK), .CE(GRD), .CLR(CLRRDREGS), .D0(Q[7]), .D1(RDC1), .D2(RDC2), .D3(RDC3), .Q0(R2D0), .Q1(R2D1),
    .Q2(R2D2), .Q3(R2D3));
  or U123 (XLXN_1347, P1SEL[0], P1SEL[1], P1SEL[2], P1SEL[3]);
  and U124 (XLXN_1346, XLXN_1347, SELPLYR);
  cd4ce U119 (.C(RDCLK), .CE(1'b1), .CLR(1'b0), .Q0(RDC0), .Q1(RDC1), .Q2(RDC2), .Q3(RDC3));  // open: CEO, TC
  fd8ce U117 (.C(SYSCLK), .CE(STP1PT), .CLR(CLEAR), .D(NPT), .Q(P1PT));
  fd8ce U118 (.C(SYSCLK), .CE(STP2PT), .CLR(CLEAR), .D(NPT), .Q(P2PT));
  m4_1e U155 (.D0(PD0PRD), .D1(PD1PRD), .D2(PD2PRD), .D3(PD3PRD), .E(1'b1), .S0(ENCPSEL0), .S1(ENCPSEL1), .O(PDPRD));
  u74_157 U152 (
    .S(SELPLYR), .G(1'b0), .Y1(PSEL0), .Y2(PSEL1), .Y3(PSEL2), .Y4(PSEL3), .A1(P1SEL[0]), .B4(P2SEL3),
    .B1(P2SEL0), .A4(P1SEL[3]), .A2(P1SEL[1]), .B3(P2SEL2), .B2(P2SEL1), .A3(P1SEL[2]));
  or U153 (ENCPSEL0, PSEL3, PSEL1);
  or U154 (ENCPSEL1, PSEL2, PSEL3);
  u74_157 U158 (
    .S(ADD), .G(1'b0), .Y1(BRWD0), .Y2(BRWD1), .Y3(BRWD2), .Y4(BRWD3), .A1(RD0), .B4(NPSELDISP3),
    .B1(NPSELDISP0), .A4(RD3), .A2(RD1), .B3(NPSELDISP2), .B2(NPSELDISP1), .A3(RD2));
  copy_of_title #(.TitleFieldText("Ppm Input/Output Block      CS2204 - E - Fall 2013"), .NameFieldText("Benson Tsai; Sharan Juangphanich; Alvi Kabir; Sean Whalen")) XLXI_718 ();
  copy_of_title #(.TitleFieldText("Ppm Human Play Block      CS2204 - E - Fall 2013"), .NameFieldText("Benson Tsai; Sharan Juangphanich; Alvi Kabir; Sean Whalen")) XLXI_719 ();
  copy_of_title #(.TitleFieldText("Ppm Play Check Block      CS2204 - E - Fall 2013"), .NameFieldText("Benson Tsai; Sharan Juangphanich; Alvi Kabir; Sean Whalen")) XLXI_720 ();
  X74_153 U157 (
    .I1C0(NPDISP0), .I1C1(NPDISP4), .I1C2(NPDISP8), .I1C3(NPDISP12), .G1(1'b0), .I2C0(NPDISP1),
    .I2C1(NPDISP5), .I2C2(NPDISP9), .I2C3(NPDISP13), .G2(1'b0), .A(ENCPSEL0), .B(ENCPSEL1), .Y1(NPSELDISP0),
    .Y2(NPSELDISP1));
  X74_153 U156 (
    .I1C0(NPDISP2), .I1C1(NPDISP6), .I1C2(NPDISP10), .I1C3(NPDISP14), .G1(1'b0), .I2C0(NPDISP3),
    .I2C1(NPDISP7), .I2C2(NPDISP11), .I2C3(NPDISP15), .G2(1'b0), .A(ENCPSEL0), .B(ENCPSEL1), .Y1(NPSELDISP2),
    .Y2(NPSELDISP3));
  u74_157 U125 (
    .S(XLXN_1346), .G(1'b0), .Y1(RD0), .Y2(RD1), .Y3(RD2), .Y4(RD3), .A1(R0D0), .B4(TRD3), .B1(P1ADD),
    .A4(R0D3), .A2(R0D1), .B3(TRD2), .B2(TRD1), .A3(R0D2));
  fd4ce U113 (
    .C(SYSCLK), .CE(STDISP3), .CLR(CLEAR), .D0(BRWD0), .D1(BRWD1), .D2(BRWD2), .D3(BRWD3), .Q0(DISP12),
    .Q1(DISP13), .Q2(DISP14), .Q3(DISP15));
  fd4ce U114 (
    .C(SYSCLK), .CE(STDISP2), .CLR(CLEAR), .D0(BRWD0), .D1(BRWD1), .D2(BRWD2), .D3(BRWD3), .Q0(DISP8),
    .Q1(DISP9), .Q2(DISP10), .Q3(DISP11));
  fd4ce U115 (
    .C(SYSCLK), .CE(STDISP1), .CLR(CLEAR), .D0(BRWD0), .D1(BRWD1), .D2(BRWD2), .D3(BRWD3), .Q0(DISP4),
    .Q1(DISP5), .Q2(DISP6), .Q3(DISP7));
  fd4ce U116 (
    .C(SYSCLK), .CE(STDISP0), .CLR(CLEAR), .D0(BRWD0), .D1(BRWD1), .D2(BRWD2), .D3(BRWD3), .Q0(DISP0),
    .Q1(DISP1), .Q2(DISP2), .Q3(DISP3));
  copy_of_title #(.TitleFieldText("Ppm Points Calculation Block      CS2204 - E - Fall 2013"), .NameFieldText("Benson Tsai; Sharan Juangphanich; Alvi Kabir; Sean Whalen")) XLXI_927 ();
  copy_of_title #(.TitleFieldText("Ppm Machine Play Block      CS2204 - E - Fall 2013"), .NameFieldText("Benson Tsai; Sharan Juangphanich; Alvi Kabir; Sean Whalen")) XLXI_928 ();
  and U18 (STP2PT, ~LPTOVF, S5);  // and2b1
  and U17 (STP1PT, ~LPTOVF, S2);  // and2b1
  and U16 (STDISP0, PSEL0, CALCPTS);
  and U4 (GETCODE, INITIALSHIFT, S0);
  ibuf P2PLAY_BUF (.I(P2PLAY_NP2B), .O(P2PLAY));
  cb2ce U6 (.C(SYSCLK), .CE(CLRSHFTREG), .CLR(CLRRDREGS), .TC(INITIALSHIFT));  // open: CEO, Q0, Q1
  buf CLEAR_BUF (CLEAR, RESET);
  fdc U72 (.C(RDCLK), .CLR(1'b0), .D(P2PLAY), .Q(XLXN_10484));
  fdc U74 (.C(SYSCLK), .CLR(1'b0), .D(XLXN_10482), .Q(XLXN_10495));
  fdc U73 (.C(P2CLK), .CLR(1'b0), .D(XLXN_10484), .Q(XLXN_10482));
  and U75 (P2PLAYSYNCH, ~XLXN_10495, XLXN_10482, XLXN_10484);  // and3b1
  cb16ce U66 (.C(CLOCK), .CE(1'b1), .CLR(1'b0), .Q(QA));  // open: CEO, TC
  cb16ce U67 (.C(QA[15]), .CE(1'b1), .CLR(1'b0), .Q(Q));  // open: CEO, TC
  bufg RDCLK_BUFG (.I(Q[1]), .O(RDCLK));
  bufg SYSCLK_BUFG (.I(Q[6]), .O(SYSCLK));
  bufg P2CLK_BUFG (.I(Q[3]), .O(P2CLK));
  fdc U76 (.C(RDCLK), .CLR(1'b0), .D(P1PLAY), .Q(XLXN_10962));
  fdc U77 (.C(P2CLK), .CLR(1'b0), .D(XLXN_10962), .Q(XLXN_10958));
  fdc U78 (.C(SYSCLK), .CLR(1'b0), .D(XLXN_10958), .Q(XLXN_10960));
  and U79 (P1PLAYSYNCH, ~XLXN_10960, XLXN_10958, XLXN_10962);  // and3b1
  and U22 (CLRRDREGS, ~XLXN_11102, XLXN_10478, XLXN_10471);  // and3b1
  and U23 (ADD, ~LPTOVF, XLXN_9551);  // and2b1
  fdc U19 (.C(P2CLK), .CLR(S1), .D(CLEAR), .Q(XLXN_10471));
  fdc U21 (.C(P2CLK), .CLR(S1), .D(XLXN_10478), .Q(XLXN_11102));
  fdc U20 (.C(P2CLK), .CLR(S1), .D(XLXN_10471), .Q(XLXN_10478));
  fdce U71 (.C(SYSCLK), .CE(XLXN_74), .CLR(CLEAR), .D(PTOVF), .Q(LPTOVF));
  fd4ce U69 (
    .C(SYSCLK), .CE(CALCPTS), .CLR(CLFF), .D0(PSEL0), .D1(PSEL1), .D2(PSEL2), .D3(PSEL3), .Q0(LPSEL0),
    .Q1(LPSEL1), .Q2(LPSEL2), .Q3(LPSEL3));
  fdce U68 (.C(SYSCLK), .CE(CALCPTS), .CLR(CLFF), .D(PDPRD), .Q(LPDPRD));
  or U70 (XLXN_74, STP2PT, STP1PT);
  add4 U151 (
    .A0(RD0), .A1(RD1), .A2(RD2), .A3(RD3), .B0(DISP8), .B1(DISP9), .B2(DISP10), .B3(DISP11), .CI(1'b0),
    .CO(PD2PRD), .S0(NPDISP8), .S1(NPDISP9), .S2(NPDISP10), .S3(NPDISP11));  // open: OFL
  add4 U149 (
    .A0(RD0), .A1(RD1), .A2(RD2), .A3(RD3), .B0(DISP0), .B1(DISP1), .B2(DISP2), .B3(DISP3), .CI(1'b0),
    .CO(PD0PRD), .S0(NPDISP0), .S1(NPDISP1), .S2(NPDISP2), .S3(NPDISP3));  // open: OFL
  add4 U148 (
    .A0(RD0), .A1(RD1), .A2(RD2), .A3(RD3), .B0(DISP4), .B1(DISP5), .B2(DISP6), .B3(DISP7), .CI(1'b0),
    .CO(PD1PRD), .S0(NPDISP4), .S1(NPDISP5), .S2(NPDISP6), .S3(NPDISP7));  // open: OFL
  or U180 (PTOVF, RWDCOT, XLXN_1802);
  comp4 U162 (
    .A0(BRWD0), .A1(BRWD1), .A2(BRWD2), .A3(BRWD3), .B0(DISP8), .B1(DISP9), .B2(DISP10), .B3(DISP11), .EQ(EQ2));
  comp4 U161 (
    .A0(BRWD0), .A1(BRWD1), .A2(BRWD2), .A3(BRWD3), .B0(DISP12), .B1(DISP13), .B2(DISP14), .B3(DISP15),
    .EQ(EQ3));
  comp4 U159 (.A0(BRWD0), .A1(BRWD1), .A2(BRWD2), .A3(BRWD3), .B0(DISP4), .B1(DISP5), .B2(DISP6), .B3(DISP7), .EQ(EQ1));
  comp4 U160 (.A0(BRWD0), .A1(BRWD1), .A2(BRWD2), .A3(BRWD3), .B0(DISP0), .B1(DISP1), .B2(DISP2), .B3(DISP3), .EQ(EQ0));
  not U175 (XLXN_1764, NSD1);
  and U177 (RWD[0], ~NSD1, ~NSD0, BRWD0);  // and3b2
  u74_157 U178 (
    .S(SELPLYR), .G(1'b0), .Y1(PT[4]), .Y2(PT[5]), .Y3(PT[6]), .Y4(PT[7]), .A1(P1PT[4]), .B4(P2PT[7]),
    .B1(P2PT[4]), .A4(P1PT[7]), .A2(P1PT[5]), .B3(P2PT[6]), .B2(P2PT[5]), .A3(P1PT[6]));
  u74_157 U179 (
    .S(SELPLYR), .G(1'b0), .Y1(PT[0]), .Y2(PT[1]), .Y3(PT[2]), .Y4(PT[3]), .A1(P1PT[0]), .B4(P2PT[3]),
    .B1(P2PT[0]), .A4(P1PT[3]), .A2(P1PT[1]), .B3(P2PT[2]), .B2(P2PT[1]), .A3(P1PT[2]));
  m2_1e U176 (.D0(BRWD1), .D1(BRWD0), .E(XLXN_1764), .S0(NSD0), .O(RWD[1]));
  X74_153 U174 (
    .I1C0(BRWD2), .I1C1(BRWD1), .I1C2(BRWD0), .I1C3(1'b0), .G1(1'b0), .I2C0(BRWD3), .I2C1(BRWD2),
    .I2C2(BRWD1), .I2C3(BRWD0), .G2(1'b0), .A(NSD0), .B(NSD1), .Y1(RWD[2]), .Y2(RWD[3]));
  and U172 (RWD[6], NSD1, NSD0, BRWD3);
  X74_153 U173 (
    .I1C0(1'b0), .I1C1(BRWD3), .I1C2(BRWD2), .I1C3(BRWD1), .G1(1'b0), .I2C0(1'b0), .I2C1(1'b0), .I2C2(BRWD3),
    .I2C3(BRWD2), .G2(1'b0), .A(NSD0), .B(NSD1), .Y1(RWD[4]), .Y2(RWD[5]));
  X74_153 U170 (
    .I1C0(RDP0EQ0), .I1C1(RDP1EQ0), .I1C2(RDP2EQ0), .I1C3(RDP3EQ0), .G1(1'b0), .I2C0(RDP0EQ1),
    .I2C1(RDP1EQ1), .I2C2(RDP2EQ1), .I2C3(RDP3EQ1), .G2(1'b0), .A(ENCPSEL0), .B(ENCPSEL1), .Y1(UNENCNSD0),
    .Y2(UNENCNSD1));
  m4_1e U169 (
    .D0(RDP0EQ2), .D1(RDP1EQ2), .D2(RDP2EQ2), .D3(RDP3EQ2), .E(1'b1), .S0(ENCPSEL0), .S1(ENCPSEL1),
    .O(UNENCNSD2));
  add4 U171 (
    .A0(UNENCNSD1), .A1(1'b0), .A2(1'b0), .A3(1'b0), .B0(UNENCNSD2), .B1(1'b0), .B2(1'b0), .B3(1'b0),
    .CI(UNENCNSD0), .S0(NSD0), .S1(NSD1));  // open: CO, OFL, S2, S3
  and U168 (RDP0EQ0, RDP0EQ1, EQ3);
  buf RDP0EQ2_BUF (RDP0EQ2, EQ1);
  and U167 (RDP0EQ1, RDP0EQ2, EQ2);
  buf RDP1EQ2_B (RDP1EQ2, EQ0);
  and U166 (RDP1EQ0, RDP1EQ1, EQ3);
  buf RDP1EQ1_BUF (RDP1EQ1, EQ2);
  buf RDP2EQ1_B (RDP2EQ1, EQ1);
  and U165 (RDP2EQ0, RDP2EQ1, EQ0);
  buf RDP2EQ2_BUF (RDP2EQ2, EQ3);
  and U164 (RDP3EQ0, RDP3EQ1, EQ0);
  buf RDP3EQ2_BUF (RDP3EQ2, EQ2);
  and U163 (RDP3EQ1, RDP3EQ2, EQ1);
  add8 U182 (.A({1'b0, RWD}), .B(CODERWD), .CI(1'b0), .CO(RWDCOT), .S(TOTRWD));  // open: OFL
  add8 U181 (.A(PT), .B(TOTRWD), .CI(1'b0), .CO(XLXN_1802), .S(NPT));  // open: OFL
  CODEGEN M1 (
    .PSEL0(PSEL0), .PSEL1(PSEL1), .CALCPTS(CALCPTS), .CLRRDREGS(CLRRDREGS), .GETCODE(GETCODE),
    .SYSCLK(SYSCLK),
    .CODERWD({CODERWD[0], CODERWD[1], CODERWD[2], CODERWD[3], CODERWD[4], CODERWD[5], CODERWD[6], CODERWD[7]}),
    .R2D1(R2D1), .R2D2(R2D2), .R1D1(R1D1), .R1D0(R1D0), .RDC1(RDC1), .R1D3(R1D3), .R2D0(R2D0), .RDC3(RDC3),
    .DISP0(DISP0), .DISP1(DISP1), .DISP2(DISP2), .DISP3(DISP3), .DISP4(DISP4), .DISP5(DISP5), .DISP6(DISP6),
    .DISP7(DISP7), .BRWD0(BRWD0), .BRWD1(BRWD1), .BRWD2(BRWD2), .BRWD3(BRWD3));
  m2_1 U272 (.D0(DISP12), .D1(P2PT[4]), .S0(DISPSEL0), .O(DDISP12));
  m2_1 U273 (.D0(DISP13), .D1(P2PT[5]), .S0(DISPSEL0), .O(DDISP13));
  m2_1 U274 (.D0(DISP14), .D1(P2PT[6]), .S0(DISPSEL0), .O(DDISP14));
  and U276 (XLXN_11289, DISP15, NOTDISPSEL0);
  and U277 (XLXN_11290, P2PT[7], DISPSEL0);
  or U278 (DDISP15, XLXN_11290, XLXN_11289);
  not U275 (NOTDISPSEL0, DISPSEL0);
  buf P1SKIP_BUF (P1SKIP, P2PLAYSYNCH);
  and U279 (XLXN_11291, ~RD3, ~DISP15, C3);  // and3b2
  and U280 (XLXN_11292, ~RD3, ~C3, DISP15);  // and3b2
  and U281 (XLXN_11293, ~C3, ~DISP15, RD3);  // and3b2
  and U282 (XLXN_11294, C3, DISP15, RD3);
  or U283 (NPDISP15, XLXN_11294, XLXN_11293, XLXN_11292, XLXN_11291);
  and U284 (XLXN_11314, C3, RD3);
  and U285 (XLXN_11315, RD3, DISP15);
  and U286 (XLXN_11316, C3, DISP15);
  or U287 (PD3PRD, XLXN_11316, XLXN_11315, XLXN_11314);
  add4 U288 (
    .A0(RD0), .A1(RD1), .A2(RD2), .A3(1'b0), .B0(DISP12), .B1(DISP13), .B2(DISP14), .B3(1'b0), .CI(1'b0),
    .S0(NPDISP12), .S1(NPDISP13), .S2(NPDISP14), .S3(C3));  // open: CO, OFL
  nor XLXI_1274 (POS0Z, DISP0, DISP1, DISP2, DISP3);
  nor XLXI_1276 (POS1Z, DISP4, DISP5, DISP6, DISP7);
  nor XLXI_1275 (POS2Z, DISP8, DISP9, DISP10, DISP11);
  nor XLXI_1277 (POS3Z, DISP12, DISP13, DISP14, DISP15);
  or XLXI_1283 (APOSZERO, POS3Z, POS2Z, POS1Z, POS0Z);
  and XLXI_1307 (ZERODISP1, ~POS1Z, ~POS0Z);  // and2b2
  and XLXI_1308 (XLXN_11554, ~POS0Z, ~POS2Z);  // and2b2
  and XLXI_1309 (XLXN_11555, ~POS0Z, POS1Z);  // and2b1
  or XLXI_1310 (ZERODISP0, XLXN_11555, XLXN_11554);
  compm4 XLXI_1367 (
    .A0(DISP0), .A1(DISP1), .A2(DISP2), .A3(DISP3), .B0(DISP4), .B1(DISP5), .B2(DISP6), .B3(DISP7),
    .LT(P1LRGDISP));  // open: GT
  compm4 XLXI_1368 (
    .A0(DISP8), .A1(DISP9), .A2(DISP10), .A3(DISP11), .B0(DISP12), .B1(DISP13), .B2(DISP14), .B3(DISP15),
    .LT(P3LRGDISP));  // open: GT
  u74_157 XLXI_1370 (
    .S(P3LRGDISP), .G(1'b0), .Y1(XLXN_11729), .Y2(XLXN_11730), .Y3(XLXN_11731), .Y4(XLXN_11732), .A1(DISP8),
    .B4(DISP15), .B1(DISP12), .A4(DISP11), .A2(DISP9), .B3(DISP14), .B2(DISP13), .A3(DISP10));
  u74_157 XLXI_1369 (
    .S(P1LRGDISP), .G(1'b0), .Y1(XLXN_11725), .Y2(XLXN_11726), .Y3(XLXN_11727), .Y4(XLXN_11728), .A1(DISP0),
    .B4(DISP7), .B1(DISP4), .A4(DISP3), .A2(DISP1), .B3(DISP6), .B2(DISP5), .A3(DISP2));
  compm4 XLXI_1374 (
    .A0(XLXN_11725), .A1(XLXN_11726), .A2(XLXN_11727), .A3(XLXN_11728), .B0(XLXN_11729), .B1(XLXN_11730),
    .B2(XLXN_11731), .B3(XLXN_11732), .LT(LRGDISPPOS1));  // open: GT
  m2_1 XLXI_1377 (.D0(P1LRGDISP), .D1(P3LRGDISP), .S0(LRGDISPPOS1), .O(LRGDISPPOS0));
  d2_4e XLXI_1320 (.A0(P2POSSEL0), .A1(P2POSSEL1), .E(1'b1), .D0(P2SEL0), .D1(P2SEL1), .D2(P2SEL2), .D3(P2SEL3));
  u74_157 XLXI_1404 (
    .S(APOSZERO), .G(1'b0), .Y1(P2POSSEL0), .Y2(P2POSSEL1), .A1(LRGDISPPOS0), .B4(1'b0), .B1(ZERODISP0),
    .A4(1'b0), .A2(LRGDISPPOS1), .B3(1'b0), .B2(ZERODISP1), .A3(1'b0));  // open: Y3, Y4
  not XLXI_1347 (P2ADD, APOSZERO);

  // Notes on the sheet:
  //   Control Signal Generation
  //   Next State Generation
  //   Latching Subsubblock
  //   Clock Signal Generation Subsubblock
  //   Timing Subblock
  //   Debouncing Subsubblock
  //   7-Segment Digit Content Selection Subsubblock
  //   I/O PADs
  //   I/O BUFFER SUB-BLOCK
  //   Display Subblock
  //   7-Segment Digit Control Subsubblock
  //   7-Segment Digit Selection Subsubblock
  //   Hex-to-7-Segment Converter Subsubblock
  //   Player's Points Storage Subsubblock
  //   Random Digit Generation Subsubblock
  //   Position Display Storage Subsubblock
  //   Points Display, Points Storage and Random Number Generation Subblock
  //   Display Add and Compare Subblock
  //   Adding RD to the Displays Subsubblock
  //   Code Storage and Code Reward Calculation Subsubblock
  //   Player 1-2 Multiplexing Subsubblock
  //   Select Digit to Store Subsubblock
  //   Select Compare Result Subsubblock
  //   Play Digit Determination Subblock
  //   Adjacency Subblock
  //   Encoded Adjacency Subsubblock
  //   Unencoded Adjacency Subsubblock
  //   Adjacent Similar Digit Subsubblock
  //   Equality Check Subsubblock
  //   Regular Reward Calculation Subblock
  //   Points Subblock
  //   Select Player Points Subblock
  //   POINTS ADDITION SUB-BLOCK
  //   Information Gathering Subblock
  //   Decision Making Subblock
endmodule
